# Altium project BEE-1012 PAY-EXP_V110.PrjPcb (part 5 of 7)

## Sheet 12_CONSOLE.SchDoc
size 420 x 297 mm; SheetNumber: 21; SheetTotal: 36
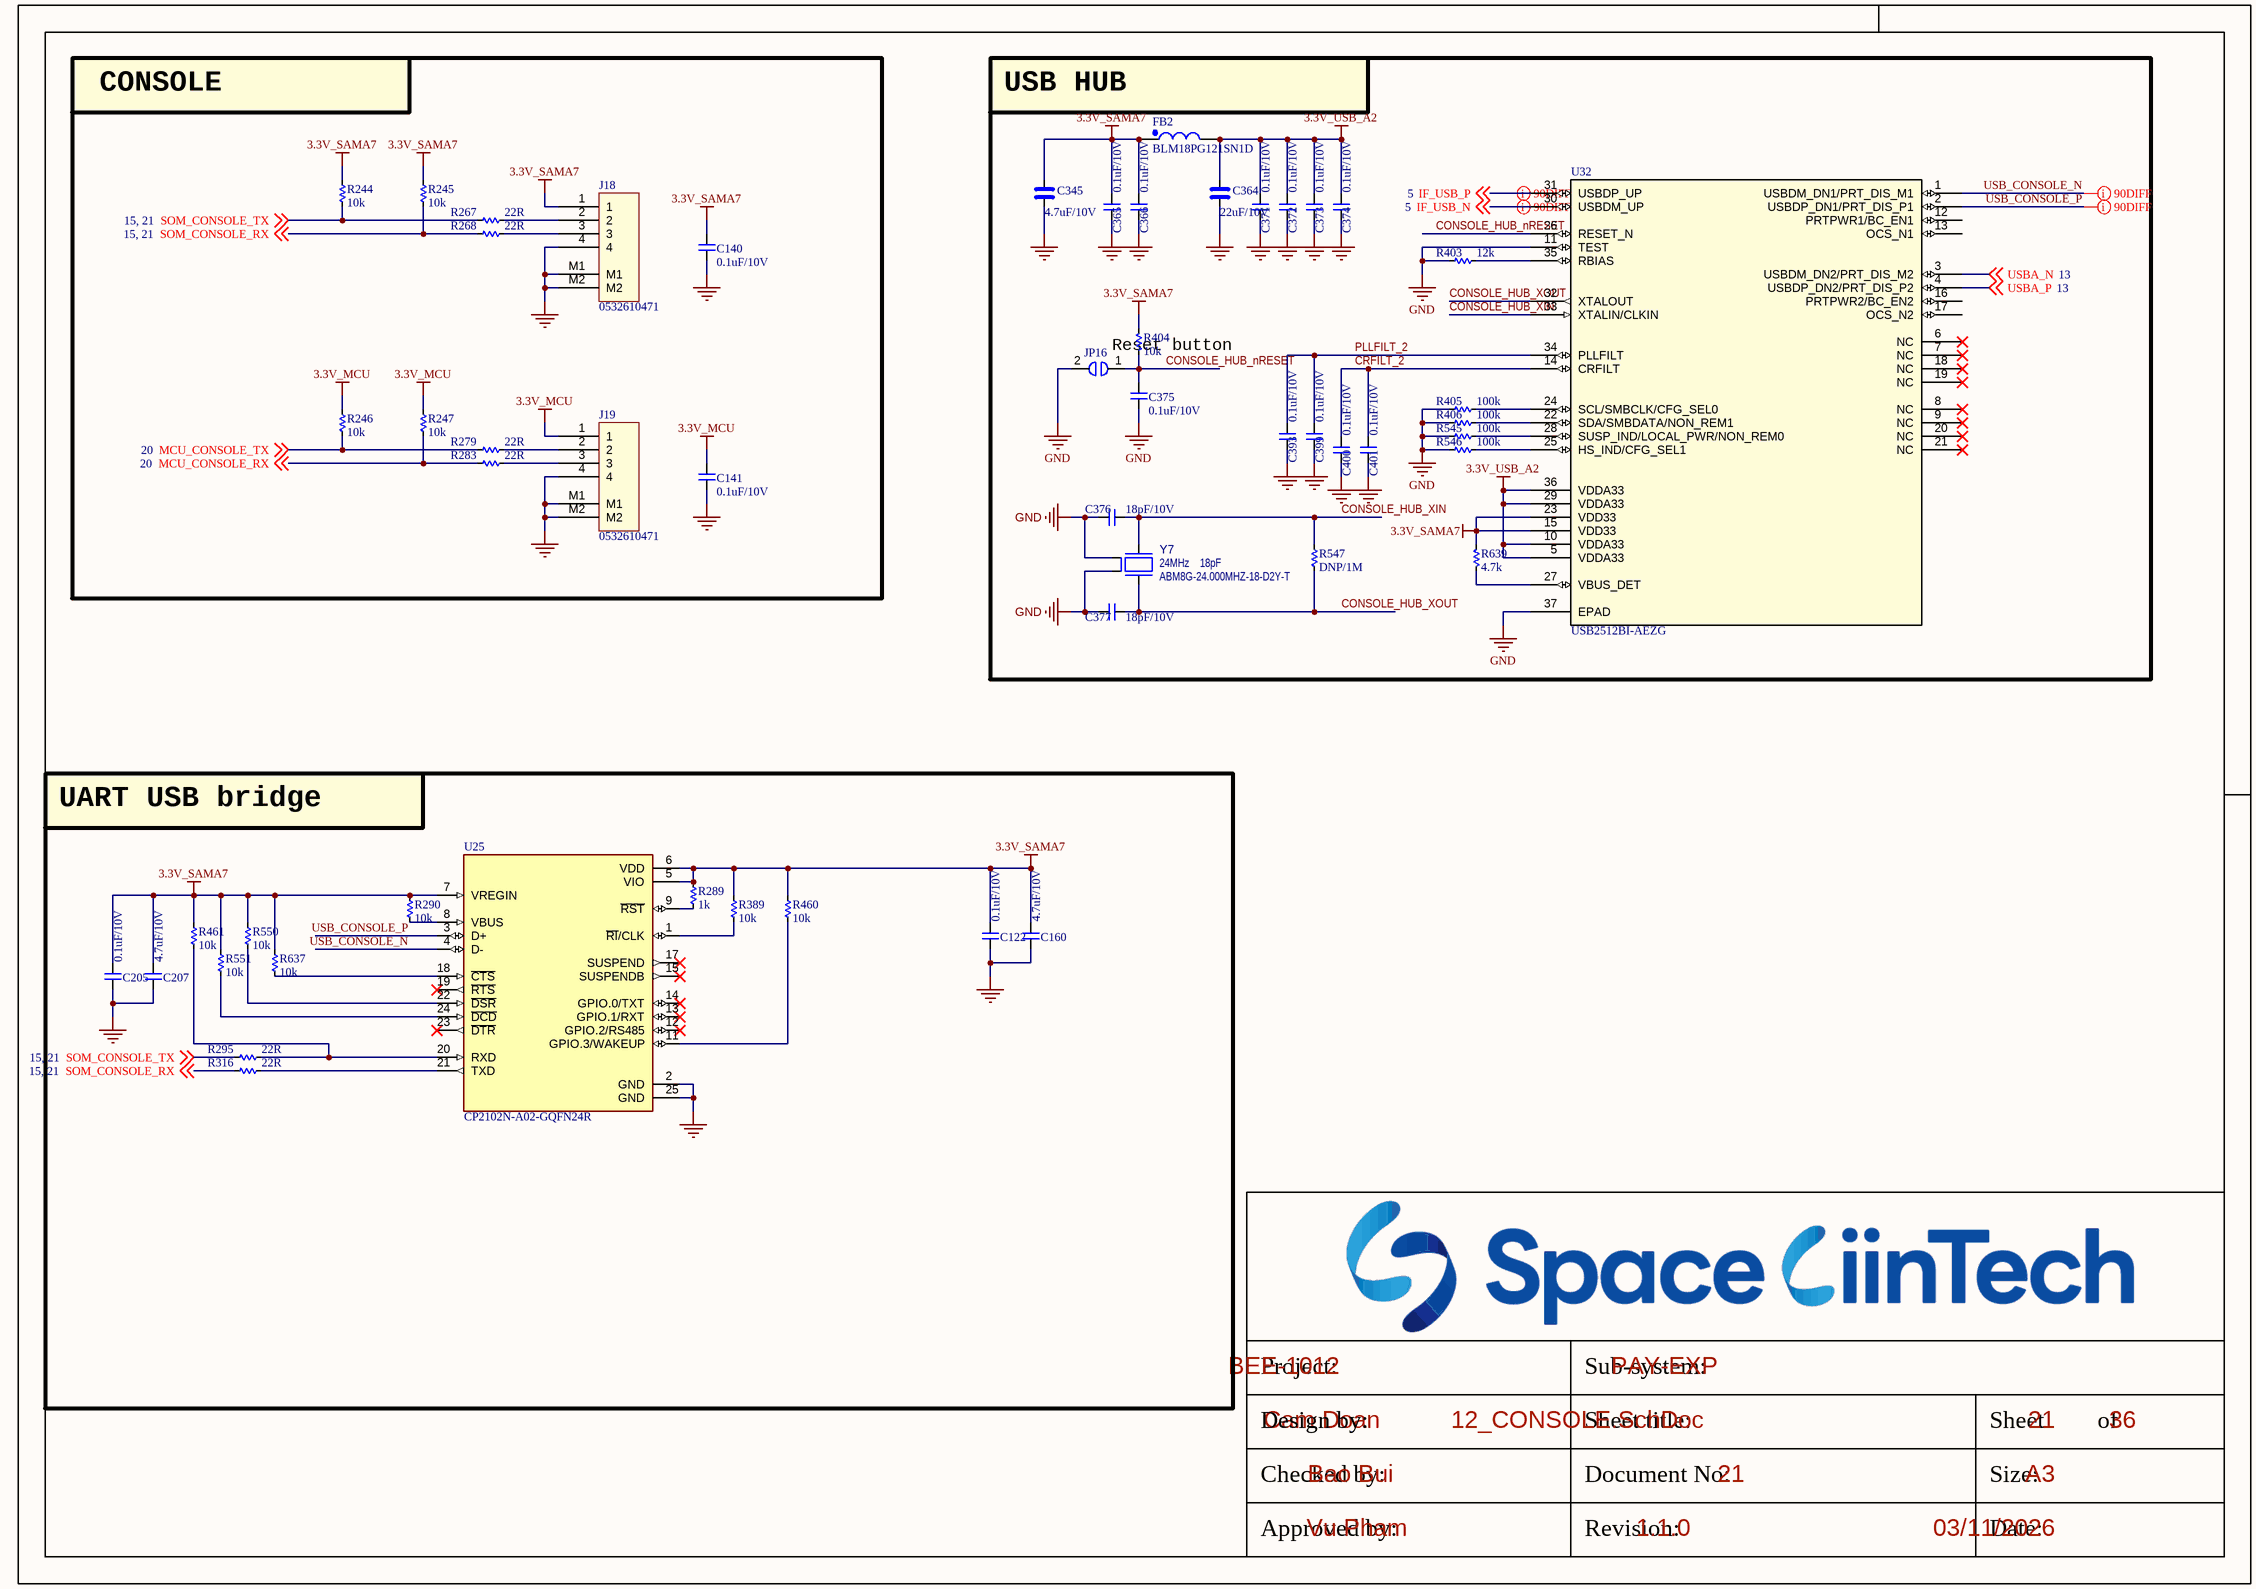
[diagram p22: 12_CONSOLE.SchDoc]

### Parts
C122  0.1uF/10V  [CAP_C_1005X60]
C140  0.1uF/10V  [CAP_C_1005X60]
C141  0.1uF/10V  [CAP_C_1005X60]
C160  4.7uF/10V  [CAP_C_1005X60]
C205  0.1uF/10V  [CAP_C_1005X60]
C207  4.7uF/10V  [CAP_C_1005X60]
C345  4.7uF/10V  [CAP_C_1608X80]
C364  22uF/10V  [CAP_C_1608X80]
C365  0.1uF/10V  [CAP_C_1005X60]
C366  0.1uF/10V  [CAP_C_1005X60]
C371  0.1uF/10V  [CAP_C_1005X60]
C372  0.1uF/10V  [CAP_C_1005X60]
C373  0.1uF/10V  [CAP_C_1005X60]
C374  0.1uF/10V  [CAP_C_1005X60]
C375  0.1uF/10V  [CAP_C_1005X60]
C376  18pF/10V  [CAP_C_1005X60]
C377  18pF/10V  [CAP_C_1005X60]
C393  0.1uF/10V  [CAP_C_1005X60]
C399  0.1uF/10V  [CAP_C_1005X60]
C400  0.1uF/10V  [CAP_C_1005X60]
C401  0.1uF/10V  [CAP_C_1005X60]
FB2  BLM18PG121SN1D  [IND_C_1608X60]
J18  0532610471  [MOLEX_0532610471]
J19  0532610471  [MOLEX_0532610471]
JP16  (no value)  [TESTPOINT_SHORT_120X100_60]
R244  10k  [RES_C_1005X40]
R245  10k  [RES_C_1005X40]
R246  10k  [RES_C_1005X40]
R247  10k  [RES_C_1005X40]
R267  22R  [RES_C_1005X40]
R268  22R  [RES_C_1005X40]
R279  22R  [RES_C_1005X40]
R283  22R  [RES_C_1005X40]
R289  1k  [RES_C_1005X40]
R290  10k  [RES_C_1005X40]
R295  22R  [RES_C_1005X40]
R316  22R  [RES_C_1005X40]
R389  10k  [RES_C_1005X40]
R403  12k  [RES_C_1005X40]
R404  10k  [RES_C_1005X40]
R405  100k  [RES_C_1005X40]
R406  100k  [RES_C_1005X40]
R460  10k  [RES_C_1005X40]
R461  10k  [RES_C_1005X40]
R545  100k  [RES_C_1005X40]
R546  100k  [RES_C_1005X40]
R547  DNP/1M  [RES_C_1005X40]
R550  10k  [RES_C_1005X40]
R551  10k  [RES_C_1005X40]
R637  10k  [RES_C_1005X40]
R639  4.7k  [RES_C_1005X40]
U25  CP2102N-A02-GQFN24R  [QFN50P400X400X80-25N]
U32  USB2512BI-AEZG  [QFN36_6X6MC_MCH]
Y7  value 24MHz  Load Capacitance: 18pF  Manufacturer Part Number 1: ABM8G-24.000MHZ-18-D2Y-T  [CRYSTAL_ABM8G]  (hidden comment: Crystal 4 Pins)

### Blocks framed on the sheet
CONSOLE: C140 C141 J18 J19 R244-R247 R267 R268 R279 R283
USB HUB: C345 C364-C366 C371-C377 C393 C399-C401 FB2 JP16 R403-R406 R545-R547 R639 U32 Y7
UART USB bridge: C122 C160 C205 C207 R289 R290 R295 R316 R389 R460 R461 R550 R551 R637 U25

### Nets
3.3V_MCU: C141.2 J19.1 R246.2 R247.2
3.3V_SAMA7: C122.1 C140.2 C160.1 C205.1 C207.1 C345.1 C365.2 C366.2 FB2.1 J18.1 R244.2 R245.2 R289.2 R290.2 R389.2 R404.1 R460.2 R461.2 R550.2 R551.2 R637.2 R639.1 U25.5(VIO) U25.6(VDD) U25.7(VREGIN) U32.15(VDD33) U32.23(VDD33)
3.3V_USB_A2: C364.1 C371.2 C372.2 C373.2 C374.2 FB2.2 U32.5(VDDA33) U32.10(VDDA33) U32.29(VDDA33) U32.36(VDDA33)
GND: C122.2 C140.1 C141.1 C160.2 C205.2 C207.2 C345.2 C364.2 C365.1 C366.1 C371.1 C372.1 C373.1 C374.1 C375.1 C376.2 C377.2 C393.1 C399.1 C400.1 C401.1 J18.4 J18.M1 J18.M2 J19.4 J19.M1 J19.M2 JP16.2 R403.1 R405.1 R406.1 R545.1 R546.1 U25.2(GND) U25.25(GND) U32.11(TEST) U32.37(EPAD) Y7.2(GND) Y7.4(GND)
CONSOLE_HUB_nRESET: C375.2 JP16.1 R404.2 U32.26(RESET_N)
CONSOLE_HUB_XIN: C376.1 R547.1 U32.33(XTALIN/CLKIN) Y7.3(Osc2)
CONSOLE_HUB_XOUT: C377.1 R547.2 U32.32(XTALOUT) Y7.1(Osc1)
CRFILT_2: C400.2 C401.2 U32.14(CRFILT)
IF_USB_N: U32.30(USBDM_UP) ; off-sheet IF_USB_N
IF_USB_P: U32.31(USBDP_UP) ; off-sheet IF_USB_P
MCU_CONSOLE_RX: R247.1 R283.2 ; off-sheet MCU_CONSOLE_RX
MCU_CONSOLE_TX: R246.1 R279.2 ; off-sheet MCU_CONSOLE_TX
PLLFILT_2: C393.2 C399.2 U32.34(PLLFILT)
SOM_CONSOLE_RX: R245.1 R268.2 R316.2 ; off-sheet SOM_CONSOLE_RX
SOM_CONSOLE_TX: R244.1 R267.2 R295.2 ; off-sheet SOM_CONSOLE_TX
USB_CONSOLE_N: U25.4(D-) U32.1(USBDM_DN1/PRT_DIS_M1)
USB_CONSOLE_P: U25.3(D+) U32.2(USBDP_DN1/PRT_DIS_P1)
USBA_N: U32.3(USBDM_DN2/PRT_DIS_M2) ; off-sheet USBA_N
USBA_P: U32.4(USBDP_DN2/PRT_DIS_P2) ; off-sheet USBA_P
NetJ18_2: J18.2 R267.1
NetJ18_3: J18.3 R268.1
NetJ19_2: J19.2 R279.1
NetJ19_3: J19.3 R283.1
NetR289_1: R289.1 U25.9(~{RST})
NetR290_1: R290.1 U25.8(VBUS)
NetR295_1: R295.1 R461.1 U25.20(RXD)
NetR316_1: R316.1 U25.21(TXD)
NetR389_1: R389.1 U25.1(~{RI}/CLK)
NetR403_2: R403.2 U32.35(RBIAS)
NetR405_2: R405.2 U32.24(SCL/SMBCLK/CFG_SEL0)
NetR406_2: R406.2 U32.22(SDA/SMBDATA/NON_REM1)
NetR460_1: R460.1 U25.11(GPIO.3/WAKEUP)
NetR545_2: R545.2 U32.28(SUSP_IND/LOCAL_PWR/NON_REM0)
NetR546_2: R546.2 U32.25(HS_IND/CFG_SEL1)
NetR550_1: R550.1 U25.22(~{DSR})
NetR551_1: R551.1 U25.24(~{DCD})
NetR637_1: R637.1 U25.18(~{CTS})
NetR639_2: R639.2 U32.27(VBUS_DET)

Not connected (* = marked no-connect by the designer): U25 12(GPIO.2/RS485)* 13(GPIO.1/RXT)* 14(GPIO.0/TXT)* 15(SUSPENDB)* 17(SUSPEND)* 19(~{RTS})* 23(~{DTR})*; U32 6(NC)* 7(NC)* 8(NC)* 9(NC)* 12(PRTPWR1/BC_EN1) 13(OCS_N1) 16(PRTPWR2/BC_EN2) 17(OCS_N2) 18(NC)* 19(NC)* 20(NC)* 21(NC)*

### Layout directives
differential pair; differential pair class DIFF90: IF_USB_N, IF_USB_P, USB_CONSOLE_N, USB_CONSOLE_P

### Notes on the sheet
- (near JP16) Reset button
- Project:
- Sub-system:
- Design by:
- Sheet title:
- Sheet
- of
- Checked by:
- Approved by:
- Revision:
- Document No:
- Size:
- Date:
- A3

### Library data of the parts
C122 C140 C141 C160 C205 C207 = _CAP_C_2: CAP
C345 C364 = _CAP_C_High_2: CAP CHIP High Value
C365 C366 C371-C377 C393 C399-C401 = _CAP_C_2: CAP CHIP
FB2 = _IND
J18 J19 = Header 4x1_2M
JP16 = JUMPER_1_1
R244-R247 R267 R268 R279 R283 R289 R290 R295 R316 R389 R403-R406 R460 R461 R545-R547 R550 R551 R637 R639 = _RES_B_2: RES
U25 = IC_USB_toUART_CP2102N-A02-GQFN24R: Value: *; MP: CP2102N-A02-GQFN24R; Package: None; Availability: Unavailable; Price: None
U32 = IC_USB_HUB_USB2512BI-AEZG: Description; Manufacturer_Name: Microchip; Copyright: Copyright (C) 2026 Ultra Librarian. All rights reserved.; Manufacturer_Part_Number: USB2512BI-AEZG; RefDes: RefDes; Type: Type
Y7 = OSC1047: Crystal; Manufacturer 1: Abracon Corporation; Description_: CRYSTAL 24MHz 18pF SMD ABM8G; Dev Tools Status: Production; Owner: Mark Loper; Populated: DNP; MCHP-ID: OSC1047; Revision: 1; Symbol: Crystal 4 Pins; Status: MCL Design; ComponentLink1URL: https://chn-vm-apps.microchip.com/mchprepo/parts/Datasheets/ABM8G.pdf; ComponentLink1Description: SVN Datasheet; ComponentLink2URL: C:\ALTIUM_WORK\00001_MCHP-CDB\Datasheets\ABM8G.pdf; ComponentLink2Description: Local Datasheet; ComponentLink3URL: C:\ALTIUM_WORK\00001_MCHP-CDB\Library\LibraryRefs\Crystal 4 Pins.SchLib; ComponentLink3Description: Open Symbol; ComponentLink4URL: C:\ALTIUM_WORK\00001_MCHP-CDB\Library\Footprints\CRYSTAL_ABM8G.PcbLib; ComponentLink4Description: Open Footprint; ComponentLink5Description: Open Footprint 2; ComponentLink6Description: Open Footprint 3; ComponentLink7Description: Open Footprint 4; Package: ABM8G; Type: Crystal; Category: Crystal/Oscillator; Supplier 1: Digi-Key; Supplier Part Number 1: 535-10273-1-ND; Quantity Override: 1

## Sheet 13_MRAM_RTC_WDT.SchDoc
size 420 x 297 mm; SheetNumber: 22; SheetTotal: 36
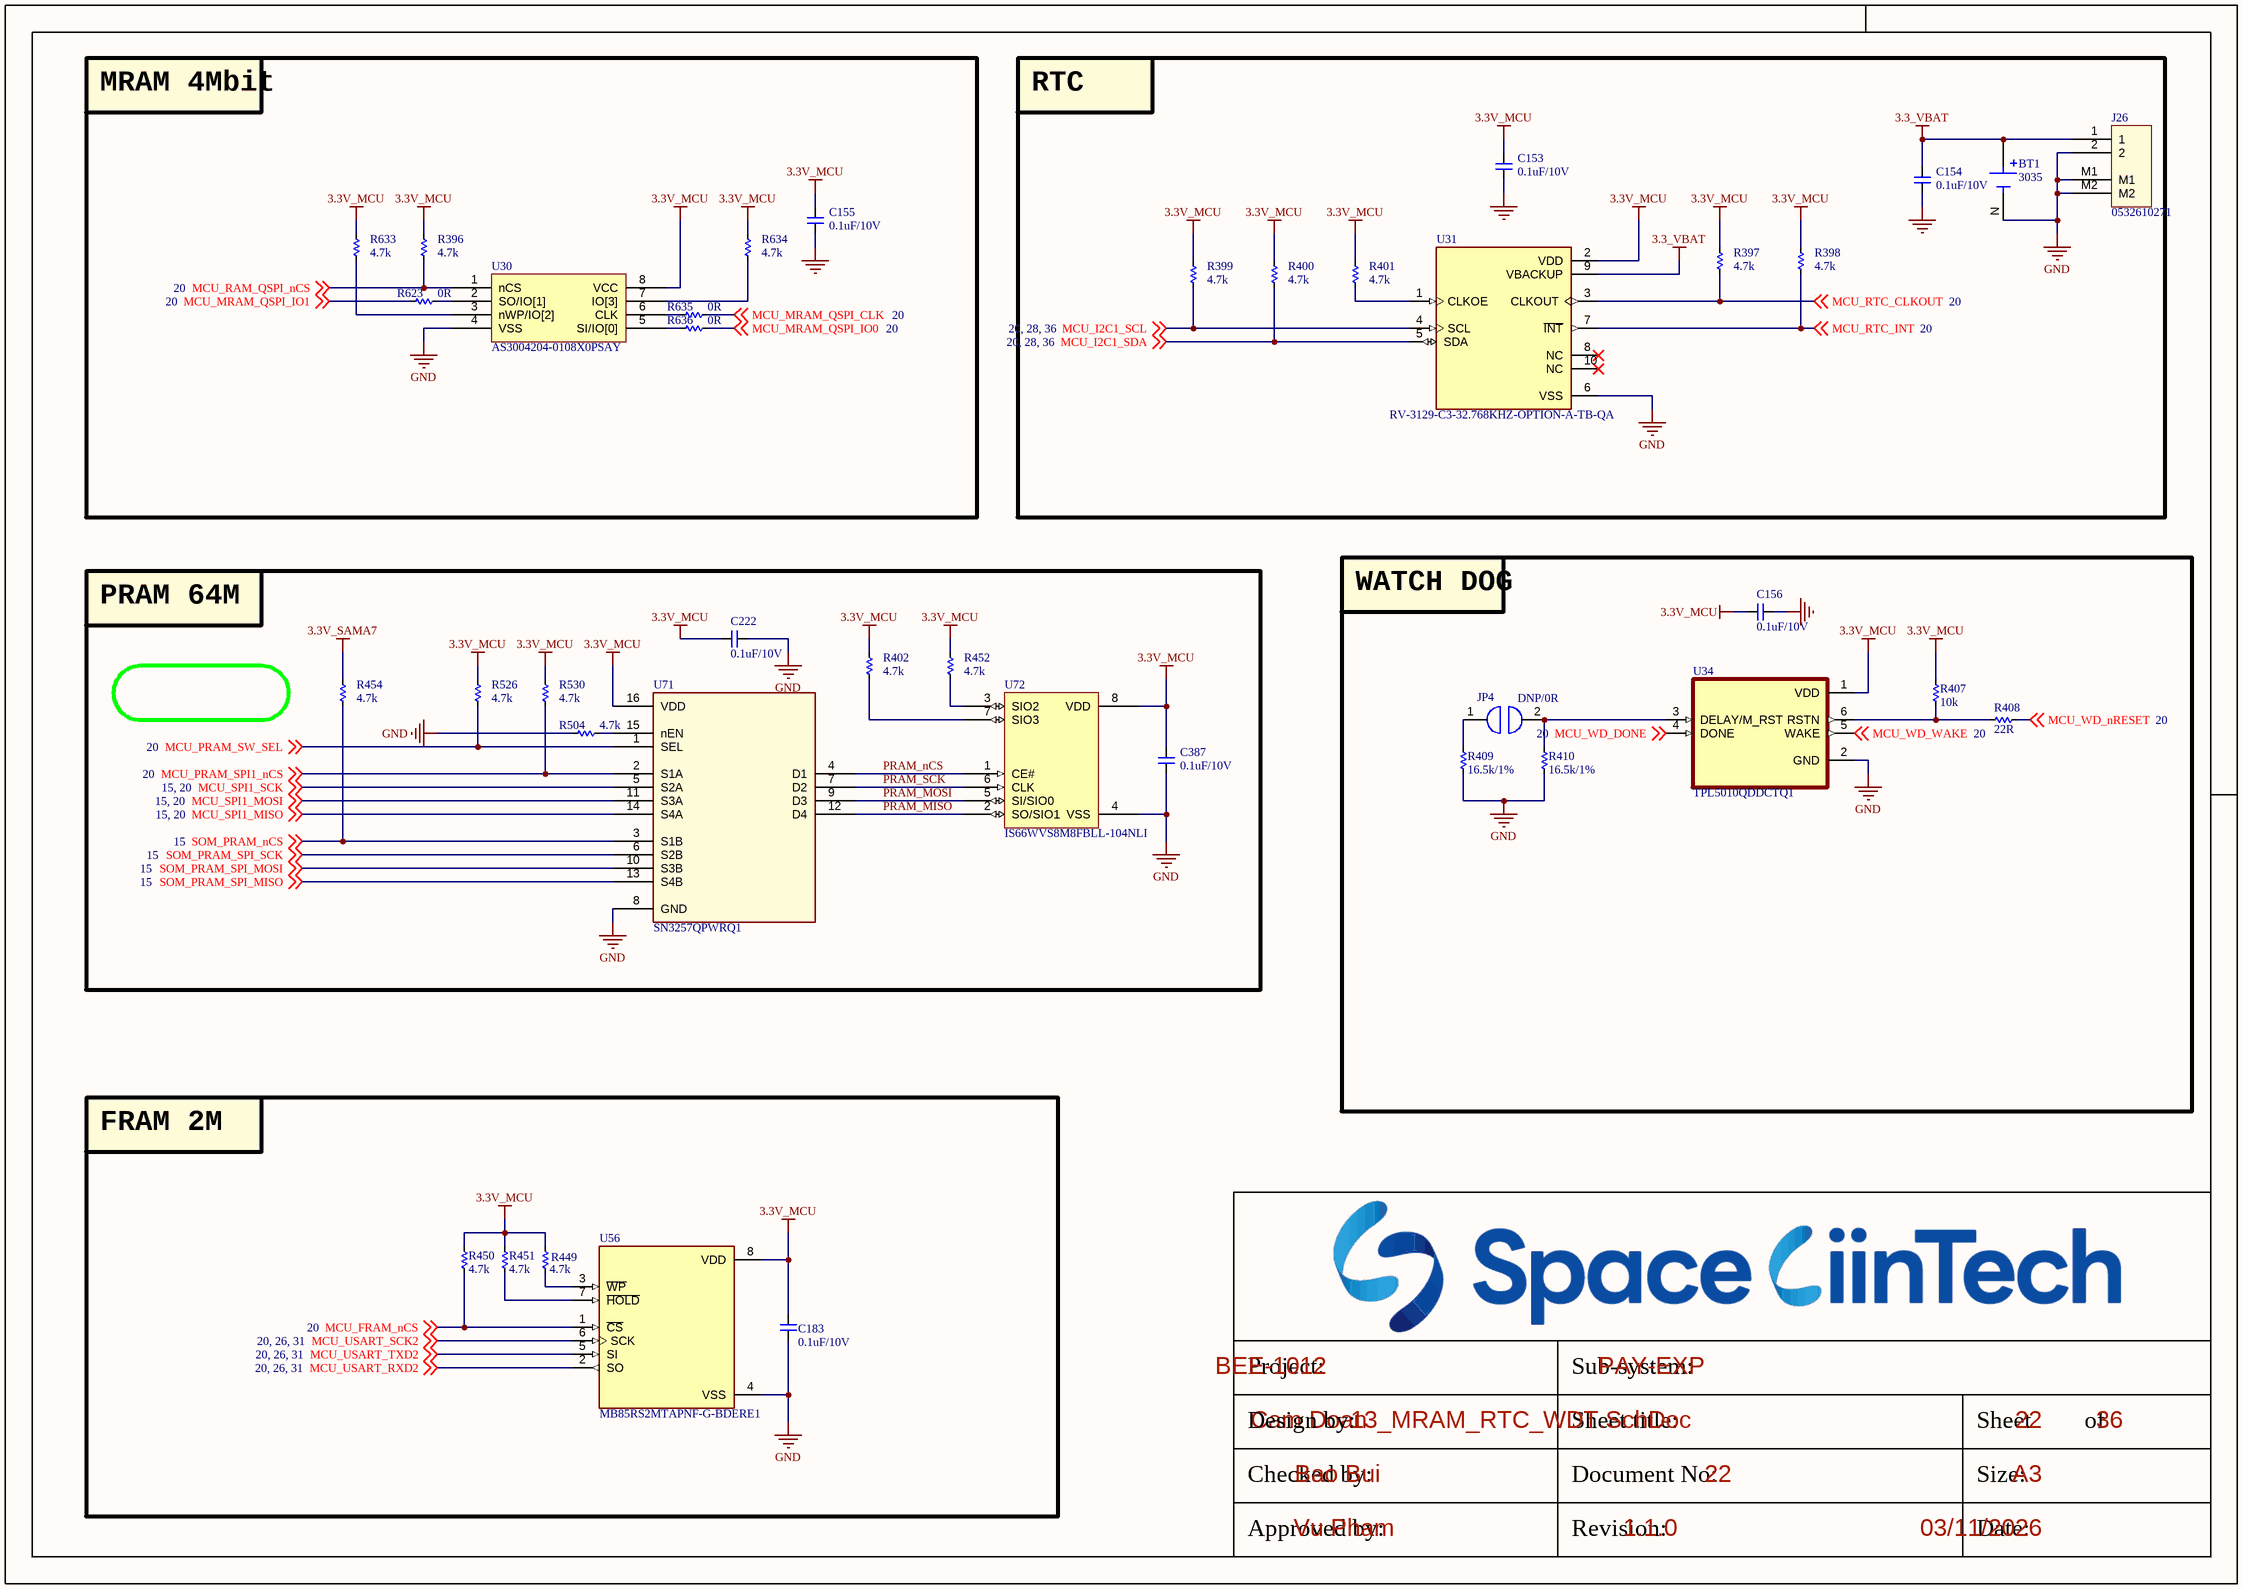
[diagram p23: 13_MRAM_RTC_WDT.SchDoc]

### Parts
(Parts that share a designator on the sheet are numbered #1, #2 ... from top to bottom, then left to right.)
BT1  3035  [BAT_3035]
C153  0.1uF/10V  [CAP_C_1005X60]
C154  0.1uF/10V  [CAP_C_1005X60]
C155  0.1uF/10V  [CAP_C_1005X60]
C156  0.1uF/10V  [CAP_C_1005X60]
C183  0.1uF/10V  [CAP_C_1005X60]
C222  0.1uF/10V  [CAP_C_1005X60]
C387#1  0.1uF/10V  [CAP_C_1005X60]
J26  0532610271  [molex_0532610271]
JP4  DNP/0R  [JUMPER_1608]
R396  4.7k  [RES_C_1005X40]
R397  4.7k  [RES_C_1005X40]
R398  4.7k  [RES_C_1005X40]
R399  4.7k  [RES_C_1005X40]
R400  4.7k  [RES_C_1005X40]
R401  4.7k  [RES_C_1005X40]
R402  4.7k  [RES_C_1005X40]
R407  10k  [RES_C_1005X40]
R408  22R  [RES_C_1005X40]
R409  16.5k/1%  [RES_C_1005X40]
R410  16.5k/1%  [RES_C_1005X40]
R449  4.7k  [RES_C_1005X40]
R450  4.7k  [RES_C_1005X40]
R451  4.7k  [RES_C_1005X40]
R452  4.7k  [RES_C_1005X40]
R454  4.7k  [RES_C_1005X40]
R504  4.7k  [RES_C_1005X40]
R526  4.7k  [RES_C_1005X40]
R530  4.7k  [RES_C_1005X40]
R623  0R  [RES_C_1005X40]
R633  4.7k  [RES_C_1005X40]
R634  4.7k  [RES_C_1005X40]
R635  0R  [RES_C_1005X40]
R636  0R  [RES_C_1005X40]
U30  AS3004204-0108X0PSAY  [SOIC127P790X216-8]
U31  RV-3129-C3-32.768KHZ-OPTION-A-TB-QA  [IC_RV-3129-C3_32.768KHZ_OPTION_A_TB_QA]
U34  TPL5010QDDCTQ1  [SOT95P280X145-6N]
U56  MB85RS2MTAPNF-G-BDERE1  [SOIC127P602X173-8N]
U71#1  SN3257QPWRQ1  [SOIC_PRQ1_TEX]
U72#1  IS66WVS8M8FBLL-104NLI  [SOIC8_150MIL_N_ISI]

### Blocks framed on the sheet
MRAM 4Mbit: C155 R396 R623 R633-R636 U30
RTC: BT1 C153 C154 J26 R397-R401 U31
PRAM 64M: C222 C387#1 R402 R452 R454 R504 R526 R530 U71#1 U72#1
WATCH DOG: C156 JP4 R407-R410 U34
FRAM 2M: C183 R449-R451 U56

### Nets
3.3_VBAT: BT1.P1(POS) BT1.P2(POS) C154.2 J26.1 U31.9(VBACKUP)
3.3V_MCU: C153.2 C155.2 C156.2 C183.2 C222.1 C387#1.1 R396.2 R397.2 R398.2 R399.2 R400.2 R401.1 R402.2 R407.2 R449.2 R450.2 R451.2 R452.2 R526.2 R530.2 R633.2 R634.2 U30.8(VCC) U31.2(VDD) U34.1(VDD) U56.8(VDD) U71#1.16(VDD) U72#1.8(VDD)
3.3V_SAMA7: R454.2
GND: BT1.N(NEG) C153.1 C154.1 C155.1 C156.1 C183.1 C222.2 C387#1.2 J26.2 J26.M1 J26.M2 R409.1 R410.1 R504.2 U30.4(VSS) U31.6(VSS) U34.2(GND) U56.4(VSS) U71#1.8(GND) U72#1.4(VSS)
MCU_FRAM_nCS: R450.1 U56.1(~{CS}) ; off-sheet MCU_FRAM_nCS
MCU_I2C1_SCL: R399.1 U31.4(SCL) ; off-sheet MCU_I2C1_SCL
MCU_I2C1_SDA: R400.1 U31.5(SDA) ; off-sheet MCU_I2C1_SDA
MCU_MRAM_QSPI_CLK: R635.1 ; off-sheet MCU_MRAM_QSPI_CLK
MCU_MRAM_QSPI_IO0: R636.1 ; off-sheet MCU_MRAM_QSPI_IO0
MCU_MRAM_QSPI_IO1: R623.2 ; off-sheet MCU_MRAM_QSPI_IO1
MCU_PRAM_SPI1_nCS: R530.1 U71#1.2(S1A) ; off-sheet MCU_PRAM_SPI1_nCS
MCU_PRAM_SW_SEL: R526.1 U71#1.1(SEL) ; off-sheet MCU_PRAM_SW_SEL
MCU_RAM_QSPI_nCS: R396.1 U30.1(nCS) ; off-sheet MCU_RAM_QSPI_nCS
MCU_RTC_CLKOUT: R397.1 U31.3(CLKOUT) ; off-sheet MCU_RTC_CLKOUT
MCU_RTC_INT: R398.1 U31.7(~{INT}) ; off-sheet MCU_RTC_INT
MCU_SPI1_MISO: U71#1.14(S4A) ; off-sheet MCU_SPI1_MISO
MCU_SPI1_MOSI: U71#1.11(S3A) ; off-sheet MCU_SPI1_MOSI
MCU_SPI1_SCK: U71#1.5(S2A) ; off-sheet MCU_SPI1_SCK
MCU_USART_RXD2: U56.2(SO) ; off-sheet MCU_USART_RXD2
MCU_USART_SCK2: U56.6(SCK) ; off-sheet MCU_USART_SCK2
MCU_USART_TXD2: U56.5(SI) ; off-sheet MCU_USART_TXD2
MCU_WD_DONE: U34.4(DONE) ; off-sheet MCU_WD_DONE
MCU_WD_nRESET: R408.1 ; off-sheet MCU_WD_nRESET
MCU_WD_WAKE: U34.5(WAKE) ; off-sheet MCU_WD_WAKE
PRAM_MISO: U71#1.12(D4) U72#1.2(SO/SIO1)
PRAM_MOSI: U71#1.9(D3) U72#1.5(SI/SIO0)
PRAM_nCS: U71#1.4(D1) U72#1.1(CE#)
PRAM_SCK: U71#1.7(D2) U72#1.6(CLK)
SOM_PRAM_nCS: R454.1 U71#1.3(S1B) ; off-sheet SOM_PRAM_nCS
SOM_PRAM_SPI_MISO: U71#1.13(S4B) ; off-sheet SOM_PRAM_SPI_MISO
SOM_PRAM_SPI_MOSI: U71#1.10(S3B) ; off-sheet SOM_PRAM_SPI_MOSI
SOM_PRAM_SPI_SCK: U71#1.6(S2B) ; off-sheet SOM_PRAM_SPI_SCK
NetJP4_1: JP4.1 R409.2
NetJP4_2: JP4.2 R410.2 U34.3(DELAY/M_RST)
NetR401_2: R401.2 U31.1(CLKOE)
NetR402_1: R402.1 U72#1.7(SIO3)
NetR407_1: R407.1 R408.2 U34.6(RSTN)
NetR449_1: R449.1 U56.3(~{WP})
NetR451_1: R451.1 U56.7(~{HOLD})
NetR452_1: R452.1 U72#1.3(SIO2)
NetR504_1: R504.1 U71#1.15(nEN)
NetR623_1: R623.1 U30.2(SO/IO[1])
NetR633_1: R633.1 U30.3(nWP/IO[2])
NetR634_1: R634.1 U30.7(IO[3])
NetR635_2: R635.2 U30.6(CLK)
NetR636_2: R636.2 U30.5(SI/IO[0])

Not connected (* = marked no-connect by the designer): U31 8(NC)* 10(NC)*

### Notes on the sheet
- Project:
- Sub-system:
- Design by:
- Sheet title:
- Sheet
- of
- Checked by:
- Approved by:
- Revision:
- Document No:
- Size:
- Date:
- A3

### Library data of the parts
BT1 = BT_HOLDER_3035: Battery Clip; THM; 20mm Cell; PhosBronze/Nickel | Keystone Electronics 3035; SnapEDA_Link: https://www.snapeda.com/parts/3035/Keystone/view-part/?ref=snap; Package: None; Value: *; MF: Keystone Electronics; MP: 3035; Check_prices: https://www.snapeda.com/parts/3035/Keystone/view-part/?ref=eda
C153-C156 C222 C387#1 = _CAP_C_2: CAP
C183 = _CAP_C_2: CAP CHIP
J26 = Header 2x1_2M
JP4 = JUMPER
R396-R402 R407-R410 R449-R452 R454 R504 R526 R530 R623 R633-R636 = _RES_B_2: RES
U30 = IC_RAM_AS3004204-0108X0PSAY
U31 = RV-3129-C3_32.768KHZ_OPTION_A_TB_QA: Real-Time Clock Module, Temperature compensated, in 2.5 x 3.7 mm package; MF: Micro Crystal; MP: RV-3129-C3 32.768KHZ OPTION A TB QA; SnapEDA_Link: https://www.snapeda.com/parts/RV-3129-C3%2032.768KHZ%20OPTION%20A%20TB%20QA/Micro+Crystal/view-part/?ref=snap; Package: QFN-10 Micro Crystal; Value: *; Check_prices: https://www.snapeda.com/parts/RV-3129-C3%2032.768KHZ%20OPTION%20A%20TB%20QA/Micro+Crystal/view-part/?ref=eda
U56 = MB85RS2MTAPNF-G-BDERE1: FRAM _Ferroelectric RAM_ Memory IC 2Mb _256K x 8_ SPI 40MHz 8-SOP; MF: Fujitsu Electronics; Package: SO-8 Fujitsu; Value: *; Digi-Key_Purchase_URL: https://www.digikey.com/product-detail/en/fujitsu-electronics-america-inc/MB85RS2MTAPNF-G-BDERE1/865-1286-1-ND/7916252?utm_source=snapeda&utm_medium=aggregator&utm_campaign=symbol; Digi-Key_Part_Number: 865-1286-1-ND; SnapEDA_Link: https://www.snapeda.com/parts/MB85RS2MTAPNF-G-BDERE1/Fujitsu%20Electronics%20America%2C%20Inc./view-part/2344795/?ref=snap; MP: MB85RS2MTAPNF-G-BDERE1
U71#1 = IC_SW_SPI_SN3257QPWRQ1: Automotive 5-V, 2:1 (SPDT), 4-channel switch with 1.8-V logic and powered-off protection 16-TSSOP -40 to 125; Manufacturer_Name: Texas Instruments; Copyright: Copyright (C) 2025 Ultra Librarian. All rights reserved.; Manufacturer_Part_Number: SN3257QPWRQ1; Datasheet: https://www.ti.com/lit/gpn/sn3257-q1; RefDes: RefDes; Type: Type
U72#1 = IS66WVS4M8BLL-104NLI: No Description Available; Manufacturer_Name: ISSI; Type: Memory; Copyright: Copyright (C) 2025 Ultra Librarian. All rights reserved.; Manufacturer_Part_Number: IS66WVS4M8BLL-104NLI; RefDes: RefDes
U34 = TPL5010QDDCTQ1: Package: None; Price: None; Value: *; MP: TPL5010QDDCTQ1; Availability: Unavailable

## Sheet 13_PRAM.SchDoc
size 420 x 297 mm; SheetNumber: 23; SheetTotal: 36
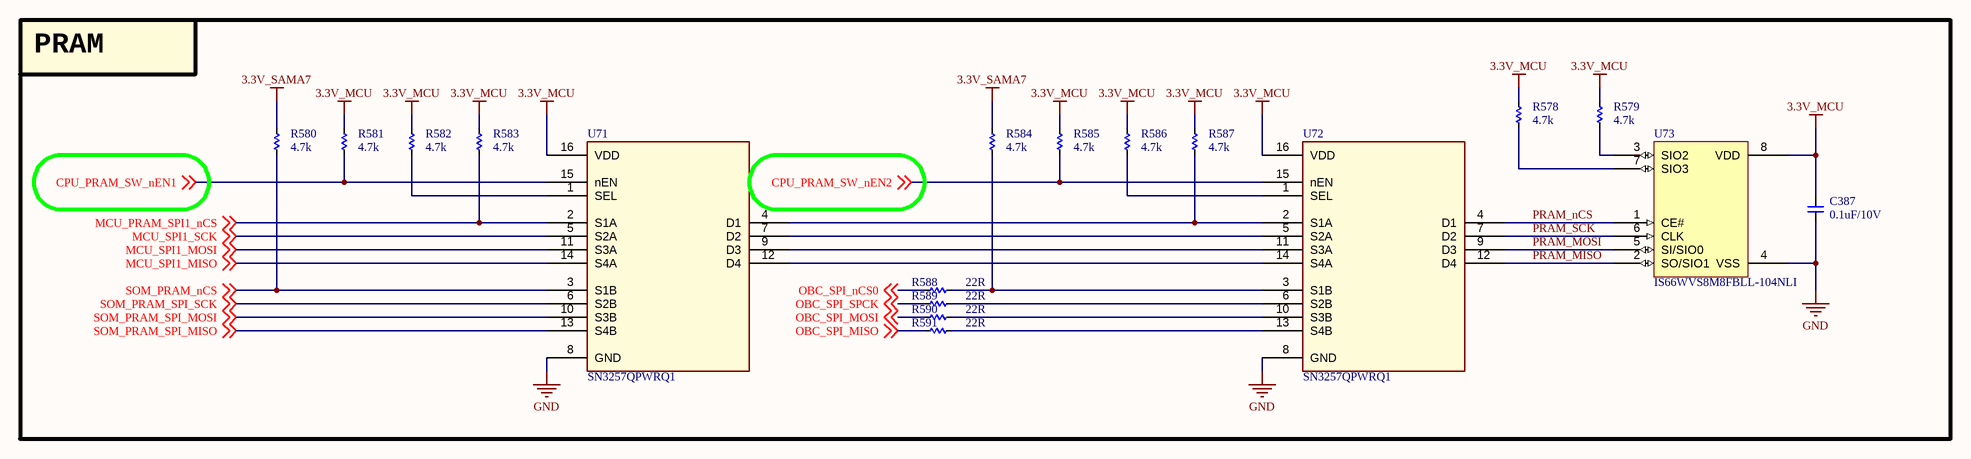
[diagram p24: 13_PRAM.SchDoc]

### Parts
(Parts that share a designator on the sheet are numbered #1, #2 ... from top to bottom, then left to right.)
C387#2  0.1uF/10V  [CAP_C_1005X50_L]
R578#2  4.7k  [RES_C_1005x30_L]
R579#2  4.7k  [RES_C_1005x30_L]
R580#2  4.7k  [RES_C_1005x30_L]
R581#2  4.7k  [RES_C_1005x30_L]
R582#2  4.7k  [RES_C_1005x30_L]
R583#2  4.7k  [RES_C_1005x30_L]
R584#2  4.7k  [RES_C_1005x30_L]
R585#2  4.7k  [RES_C_1005x30_L]
R586#2  4.7k  [RES_C_1005x30_L]
R587#2  4.7k  [RES_C_1005x30_L]
R588#2  22R  [RES_C_1005x30_L]
R589#2  22R  [RES_C_1005x30_L]
R590#2  22R  [RES_C_1005x30_L]
R591#2  22R  [RES_C_1005x30_L]
U71#2  SN3257QPWRQ1  [SOIC_PRQ1_TEX]
U72#2  SN3257QPWRQ1  [SOIC_PRQ1_TEX]
U73#1  IS66WVS8M8FBLL-104NLI  [SOIC8_150MIL_N_ISI]

### Blocks framed on the sheet
PRAM: C387#2 R578#2 R579#2 R580#2 R581#2 R582#2 R583#2 R584#2 R585#2 R586#2 R587#2 R588#2 R589#2 R590#2 R591#2 U71#2 U72#2 U73#1

### Nets
3.3V_MCU: C387#2.1 R578#2.2 R579#2.2 R581#2.2 R582#2.2 R583#2.2 R585#2.2 R586#2.2 R587#2.2 U71#2.16(VDD) U72#2.16(VDD) U73#1.8(VDD)
3.3V_SAMA7: R580#2.2 R584#2.2
GND: C387#2.2 U71#2.8(GND) U72#2.8(GND) U73#1.4(VSS)
CPU_PRAM_SW_nEN1: R581#2.1 U71#2.15(nEN) ; off-sheet CPU_PRAM_SW_nEN1
CPU_PRAM_SW_nEN2: R585#2.1 U72#2.15(nEN) ; off-sheet CPU_PRAM_SW_nEN2
MCU_PRAM_SPI1_nCS: R583#2.1 U71#2.2(S1A) ; off-sheet MCU_PRAM_SPI1_nCS
MCU_SPI1_MISO: U71#2.14(S4A) ; off-sheet MCU_SPI1_MISO
MCU_SPI1_MOSI: U71#2.11(S3A) ; off-sheet MCU_SPI1_MOSI
MCU_SPI1_SCK: U71#2.5(S2A) ; off-sheet MCU_SPI1_SCK
OBC_SPI_MISO: R591#2.2 ; off-sheet OBC_SPI_MISO
OBC_SPI_MOSI: R590#2.2 ; off-sheet OBC_SPI_MOSI
OBC_SPI_nCS0: R588#2.2 ; off-sheet OBC_SPI_nCS0
OBC_SPI_SPCK: R589#2.2 ; off-sheet OBC_SPI_SPCK
PRAM_MISO: U72#2.12(D4) U73#1.2(SO/SIO1)
PRAM_MOSI: U72#2.9(D3) U73#1.5(SI/SIO0)
PRAM_nCS: U72#2.4(D1) U73#1.1(CE#)
PRAM_SCK: U72#2.7(D2) U73#1.6(CLK)
SOM_PRAM_nCS: R580#2.1 U71#2.3(S1B) ; off-sheet SOM_PRAM_nCS
SOM_PRAM_SPI_MISO: U71#2.13(S4B) ; off-sheet SOM_PRAM_SPI_MISO
SOM_PRAM_SPI_MOSI: U71#2.10(S3B) ; off-sheet SOM_PRAM_SPI_MOSI
SOM_PRAM_SPI_SCK: U71#2.6(S2B) ; off-sheet SOM_PRAM_SPI_SCK
NetR578#2_1: R578#2.1 U73#1.7(SIO3)
NetR579#2_1: R579#2.1 U73#1.3(SIO2)
NetR582#2_1: R582#2.1 U71#2.1(SEL)
NetR584#2_1: R584#2.1 R588#2.1 U72#2.3(S1B)
NetR586#2_1: R586#2.1 U72#2.1(SEL)
NetR587#2_1: R587#2.1 U71#2.4(D1) U72#2.2(S1A)
NetR589#2_1: R589#2.1 U72#2.6(S2B)
NetR590#2_1: R590#2.1 U72#2.10(S3B)
NetR591#2_1: R591#2.1 U72#2.13(S4B)
NetU71#2_7: U71#2.7(D2) U72#2.5(S2A)
NetU71#2_9: U71#2.9(D3) U72#2.11(S3A)
NetU71#2_12: U71#2.12(D4) U72#2.14(S4A)

### Notes on the sheet
- Project:
- Sub-system:
- Design by:
- Sheet title:
- Sheet
- of
- Checked by:
- Approved by:
- Revision:
- Document No:
- Size:
- Date:
- A3

### Library data of the parts
C387#2 = _CAP_C_2: CAP
R578#2 R579#2 R580#2 R581#2 R582#2 R583#2 R584#2 R585#2 R586#2 R587#2 R588#2 R589#2 R590#2 R591#2 = _RES_B_2: RES
U71#2 U72#2 = IC_SW_SPI_SN3257QPWRQ1: as U71#1 on sheet 13_MRAM_RTC_WDT; Copyright: Copyright (C) 2025 Ultra Librarian. All rights reserved.; Manufacturer_Part_Number: SN3257QPWRQ1; Datasheet: https://www.ti.com/lit/gpn/sn3257-q1; RefDes: RefDes; Type: Type
U73#1 = IS66WVS4M8BLL-104NLI: as U72#1 on sheet 13_MRAM_RTC_WDT; Type: Memory; Copyright: Copyright (C) 2025 Ultra Librarian. All rights reserved.; Manufacturer_Part_Number: IS66WVS4M8BLL-104NLI; RefDes: RefDes

## Sheet 14_NTC_TEMPSENSOR.SchDoc
size 420 x 297 mm; SheetNumber: 24; SheetTotal: 36
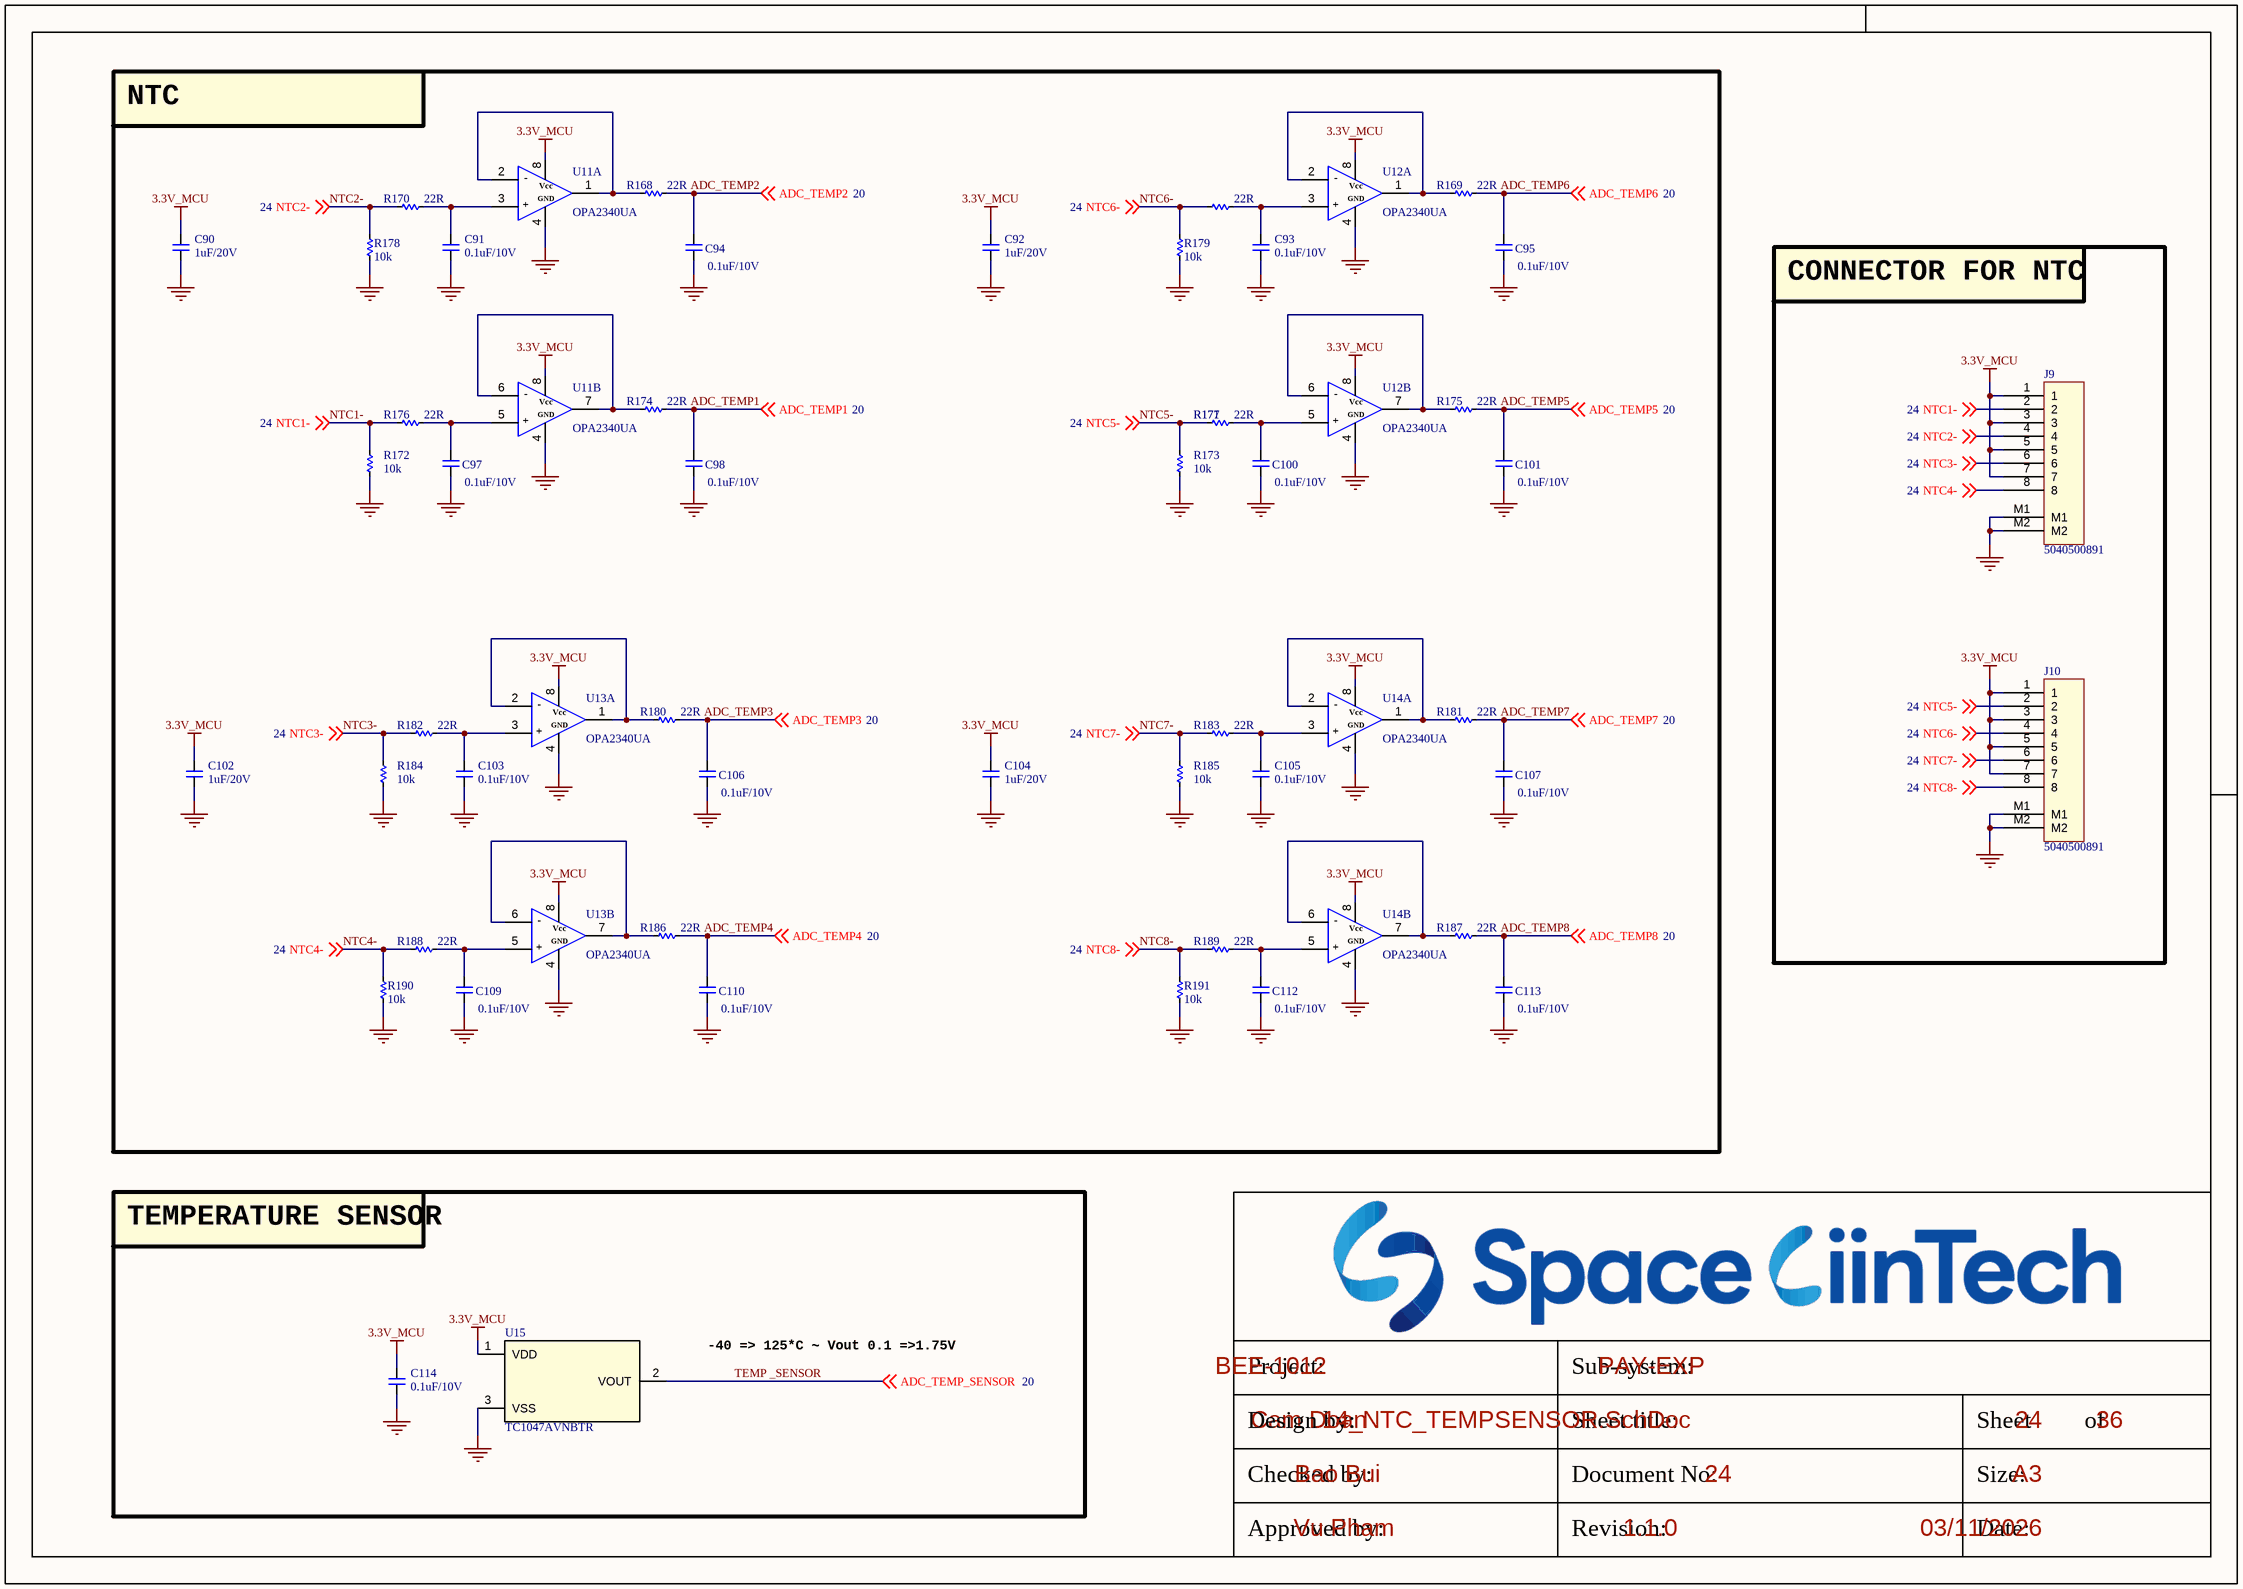
[diagram p25: 14_NTC_TEMPSENSOR.SchDoc]

### Parts
C90  1uF/20V  [CAP_C_1005X50_L]
C91  0.1uF/10V  [CAP_C_1005X50_L]
C92  1uF/20V  [CAP_C_1005X50_L]
C93  0.1uF/10V  [CAP_C_1005X50_L]
C94  0.1uF/10V  [CAP_C_1005X50_L]
C95  0.1uF/10V  [CAP_C_1005X50_L]
C97  0.1uF/10V  [CAP_C_1005X50_L]
C98  0.1uF/10V  [CAP_C_1005X50_L]
C100  0.1uF/10V  [CAP_C_1005X50_L]
C101  0.1uF/10V  [CAP_C_1005X50_L]
C102  1uF/20V  [CAP_C_1005X50_L]
C103  0.1uF/10V  [CAP_C_1005X50_L]
C104  1uF/20V  [CAP_C_1005X50_L]
C105  0.1uF/10V  [CAP_C_1005X50_L]
C106  0.1uF/10V  [CAP_C_1005X50_L]
C107  0.1uF/10V  [CAP_C_1005X50_L]
C109  0.1uF/10V  [CAP_C_1005X50_L]
C110  0.1uF/10V  [CAP_C_1005X50_L]
C112  0.1uF/10V  [CAP_C_1005X50_L]
C113  0.1uF/10V  [CAP_C_1005X50_L]
C114  0.1uF/10V  [CAP_C_1005X50_L]
J9  5040500891  [MOLEX_5040500891]
J10  5040500891  [MOLEX_5040500891]
R168  22R  [RES_C_1005x30_L]
R169  22R  [RES_C_1005x30_L]
R170  22R  [RES_C_1005x30_L]
R171  22R  [RES_C_1005x30_L]
R172  10k  [RES_C_1005x30_L]
R173  10k  [RES_C_1005x30_L]
R174  22R  [RES_C_1005x30_L]
R175  22R  [RES_C_1005x30_L]
R176  22R  [RES_C_1005x30_L]
R177  22R  [RES_C_1005x30_L]
R178  10k  [RES_C_1005x30_L]
R179  10k  [RES_C_1005x30_L]
R180  22R  [RES_C_1005x30_L]
R181  22R  [RES_C_1005x30_L]
R182  22R  [RES_C_1005x30_L]
R183  22R  [RES_C_1005x30_L]
R184  10k  [RES_C_1005x30_L]
R185  10k  [RES_C_1005x30_L]
R186  22R  [RES_C_1005x30_L]
R187  22R  [RES_C_1005x30_L]
R188  22R  [RES_C_1005x30_L]
R189  22R  [RES_C_1005x30_L]
R190  10k  [RES_C_1005x30_L]
R191  10k  [RES_C_1005x30_L]
U11  OPA2340UA  [SOIC127P602X173-8N]  (parts A,B of 2)
U12  OPA2340UA  [SOIC127P602X173-8N]  (parts A,B of 2)
U13  OPA2340UA  [SOIC127P602X173-8N]  (parts A,B of 2)
U14  OPA2340UA  [SOIC127P602X173-8N]  (parts A,B of 2)
U15  TC1047AVNBTR  [SOT95P240X120-3N]

### Blocks framed on the sheet
NTC: C90-C95 C97 C98 C100-C107 C109 C110 C112 C113 R168-R191 U11-U14
CONNECTOR FOR NTC: J9 J10
TEMPERATURE SENSOR: C114 U15

### Nets
3.3V_MCU: C90.2 C92.2 C102.2 C104.2 C114.2 J9.1 J9.3 J9.5 J9.7 J10.1 J10.3 J10.5 J10.7 U11.8 U12.8 U13.8 U14.8 U15.1(VDD)
GND: C90.1 C91.1 C92.1 C93.1 C94.1 C95.1 C97.1 C98.1 C100.1 C101.1 C102.1 C103.1 C104.1 C105.1 C106.1 C107.1 C109.1 C110.1 C112.1 C113.1 C114.1 J9.M1 J9.M2 J10.M1 J10.M2 R172.1 R173.1 R178.1 R179.1 R184.1 R185.1 R190.1 R191.1 U11.4 U12.4 U13.4 U14.4 U15.3(VSS)
ADC_TEMP1: C98.2 R174.2 ; off-sheet ADC_TEMP1
ADC_TEMP2: C94.2 R168.2 ; off-sheet ADC_TEMP2
ADC_TEMP3: C106.2 R180.2 ; off-sheet ADC_TEMP3
ADC_TEMP4: C110.2 R186.2 ; off-sheet ADC_TEMP4
ADC_TEMP5: C101.2 R175.2 ; off-sheet ADC_TEMP5
ADC_TEMP6: C95.2 R169.2 ; off-sheet ADC_TEMP6
ADC_TEMP7: C107.2 R181.2 ; off-sheet ADC_TEMP7
ADC_TEMP8: C113.2 R187.2 ; off-sheet ADC_TEMP8
NTC1-: J9.2 R172.2 R176.1 ; off-sheet NTC1-
NTC2-: J9.4 R170.1 R178.2 ; off-sheet NTC2-
NTC3-: J9.6 R182.1 R184.2 ; off-sheet NTC3-
NTC4-: J9.8 R188.1 R190.2 ; off-sheet NTC4-
NTC5-: J10.2 R173.2 R177.1 ; off-sheet NTC5-
NTC6-: J10.4 R171.1 R179.2 ; off-sheet NTC6-
NTC7-: J10.6 R183.1 R185.2 ; off-sheet NTC7-
NTC8-: J10.8 R189.1 R191.2 ; off-sheet NTC8-
TEMP _SENSOR: U15.2(VOUT) ; off-sheet ADC_TEMP_SENSOR  [also labelled ADC_TEMP_SENSOR]
NetC91_2: C91.2 R170.2 U11.3
NetC93_2: C93.2 R171.2 U12.3
NetC97_2: C97.2 R176.2 U11.5
NetC100_2: C100.2 R177.2 U12.5
NetC103_2: C103.2 R182.2 U13.3
NetC105_2: C105.2 R183.2 U14.3
NetC109_2: C109.2 R188.2 U13.5
NetC112_2: C112.2 R189.2 U14.5
NetR168_1: R168.1 U11.1 U11.2
NetR169_1: R169.1 U12.1 U12.2
NetR174_1: R174.1 U11.6 U11.7
NetR175_1: R175.1 U12.6 U12.7
NetR180_1: R180.1 U13.1 U13.2
NetR181_1: R181.1 U14.1 U14.2
NetR186_1: R186.1 U13.6 U13.7
NetR187_1: R187.1 U14.6 U14.7

### Notes on the sheet
- -40 => 125*C ~ Vout 0.1 =>1.75V
- Project:
- Sub-system:
- Design by:
- Sheet title:
- Sheet
- of
- Checked by:
- Approved by:
- Revision:
- Document No:
- Size:
- Date:
- A3
- (in symbol OPA2340UA, part A) -; Vcc; GND; +
- (in symbol OPA2340UA, part B) -; Vcc; GND; +

### Library data of the parts
C90-C95 C97 C98 C100-C107 C109 C110 C112-C114 = _CAP_C_2: CAP
J9 J10 = Header 8x1_2M
R168-R191 = _RES_B_2: RES
U15 = IC_SENSOR_TC1047AVNBTR: Temperature Sensor Analog, Local -40°C ~ 125°C 10mV/°C SOT-23-3

## Sheet 15_HEATER.SchDoc
size 420 x 297 mm; SheetNumber: 25; SheetTotal: 36
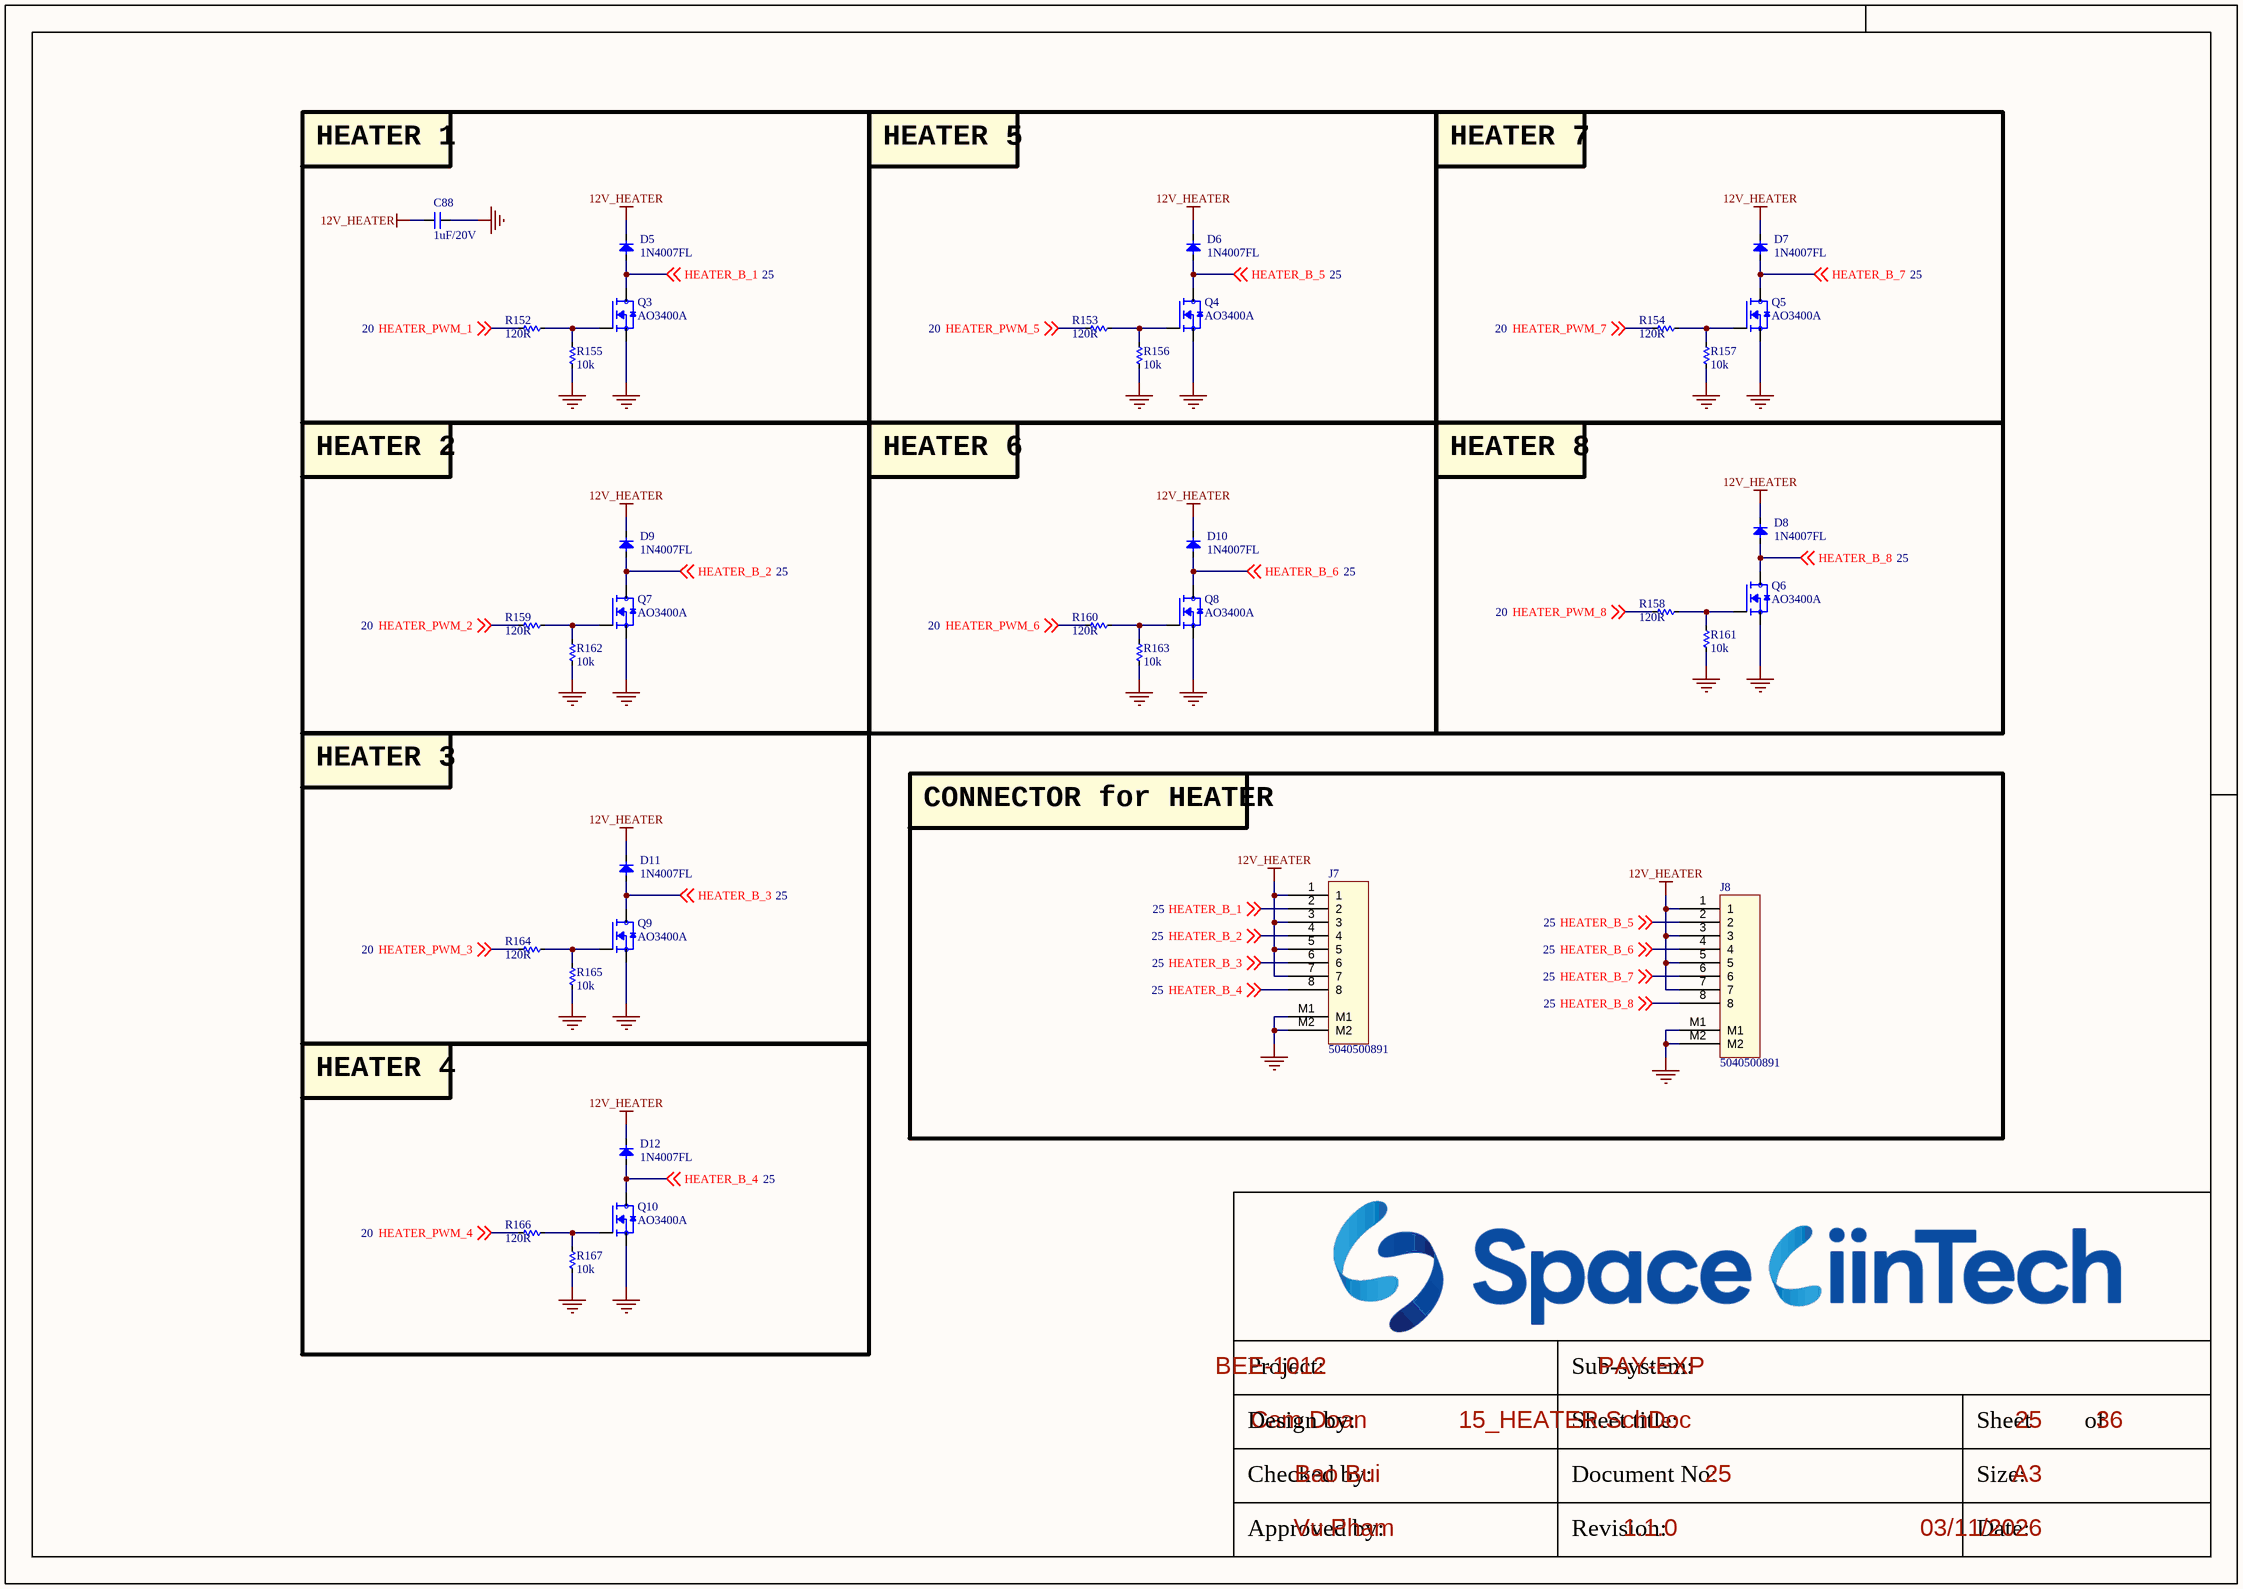
[diagram p26: 15_HEATER.SchDoc]

### Parts
C88  1uF/20V  [CAP_C_1005X50_L]
D5  1N4007FL  [SOD3717X145N]
D6  1N4007FL  [SOD3717X145N]
D7  1N4007FL  [SOD3717X145N]
D8  1N4007FL  [SOD3717X145N]
D9  1N4007FL  [SOD3717X145N]
D10  1N4007FL  [SOD3717X145N]
D11  1N4007FL  [SOD3717X145N]
D12  1N4007FL  [SOD3717X145N]
J7  5040500891  [MOLEX_5040500891]
J8  5040500891  [MOLEX_5040500891]
Q3  AO3400A  [SOT95P240X120-3N]
Q4  AO3400A  [SOT95P240X120-3N]
Q5  AO3400A  [SOT95P240X120-3N]
Q6  AO3400A  [SOT95P240X120-3N]
Q7  AO3400A  [SOT95P240X120-3N]
Q8  AO3400A  [SOT95P240X120-3N]
Q9  AO3400A  [SOT95P240X120-3N]
Q10  AO3400A  [SOT95P240X120-3N]
R152  120R  [RES_C_1005x30_L]
R153  120R  [RES_C_1005x30_L]
R154  120R  [RES_C_1005x30_L]
R155  10k  [RES_C_1005x30_L]
R156  10k  [RES_C_1005x30_L]
R157  10k  [RES_C_1005x30_L]
R158  120R  [RES_C_1005x30_L]
R159  120R  [RES_C_1005x30_L]
R160  120R  [RES_C_1005x30_L]
R161  10k  [RES_C_1005x30_L]
R162  10k  [RES_C_1005x30_L]
R163  10k  [RES_C_1005x30_L]
R164  120R  [RES_C_1005x30_L]
R165  10k  [RES_C_1005x30_L]
R166  120R  [RES_C_1005x30_L]
R167  10k  [RES_C_1005x30_L]

### Blocks framed on the sheet
HEATER 1: C88 D5 Q3 R152 R155
HEATER 5: D6 Q4 R153 R156
HEATER 7: D7 Q5 R154 R157
HEATER 2: D9 Q7 R159 R162
HEATER 6: D10 Q8 R160 R163
HEATER 8: D8 Q6 R158 R161
HEATER 3: D11 Q9 R164 R165
CONNECTOR for HEATER: J7 J8
HEATER 4: D12 Q10 R166 R167

### Nets
12V_HEATER: C88.2 D5.1(K) D6.1(K) D7.1(K) D8.1(K) D9.1(K) D10.1(K) D11.1(K) D12.1(K) J7.1 J7.3 J7.5 J7.7 J8.1 J8.3 J8.5 J8.7
GND: C88.1 J7.M1 J7.M2 J8.M1 J8.M2 Q3.2(S) Q4.2(S) Q5.2(S) Q6.2(S) Q7.2(S) Q8.2(S) Q9.2(S) Q10.2(S) R155.1 R156.1 R157.1 R161.1 R162.1 R163.1 R165.1 R167.1
HEATER_B_1: D5.2(A) J7.2 Q3.3(D) ; off-sheet HEATER_B_1
HEATER_B_2: D9.2(A) J7.4 Q7.3(D) ; off-sheet HEATER_B_2
HEATER_B_3: D11.2(A) J7.6 Q9.3(D) ; off-sheet HEATER_B_3
HEATER_B_4: D12.2(A) J7.8 Q10.3(D) ; off-sheet HEATER_B_4
HEATER_B_5: D6.2(A) J8.2 Q4.3(D) ; off-sheet HEATER_B_5
HEATER_B_6: D10.2(A) J8.4 Q8.3(D) ; off-sheet HEATER_B_6
HEATER_B_7: D7.2(A) J8.6 Q5.3(D) ; off-sheet HEATER_B_7
HEATER_B_8: D8.2(A) J8.8 Q6.3(D) ; off-sheet HEATER_B_8
HEATER_PWM_1: R152.1 ; off-sheet HEATER_PWM_1
HEATER_PWM_2: R159.1 ; off-sheet HEATER_PWM_2
HEATER_PWM_3: R164.1 ; off-sheet HEATER_PWM_3
HEATER_PWM_4: R166.1 ; off-sheet HEATER_PWM_4
HEATER_PWM_5: R153.1 ; off-sheet HEATER_PWM_5
HEATER_PWM_6: R160.1 ; off-sheet HEATER_PWM_6
HEATER_PWM_7: R154.1 ; off-sheet HEATER_PWM_7
HEATER_PWM_8: R158.1 ; off-sheet HEATER_PWM_8
NetQ3_1: Q3.1(G) R152.2 R155.2
NetQ4_1: Q4.1(G) R153.2 R156.2
NetQ5_1: Q5.1(G) R154.2 R157.2
NetQ6_1: Q6.1(G) R158.2 R161.2
NetQ7_1: Q7.1(G) R159.2 R162.2
NetQ8_1: Q8.1(G) R160.2 R163.2
NetQ9_1: Q9.1(G) R164.2 R165.2
NetQ10_1: Q10.1(G) R166.2 R167.2

### Notes on the sheet
- Project:
- Sub-system:
- Design by:
- Sheet title:
- Sheet
- of
- Checked by:
- Approved by:
- Revision:
- Document No:
- Size:
- Date:
- A3

### Library data of the parts
C88 = _CAP_C_2: CAP
D5-D12 = Diode SMD: Default Diode; Code - JEDEC: DO-214-AB; Value: 1N5007; Published: 8-Jun-2000; Revision: July-2002: Re-released for DXP Platform.; Publisher: Altium Limited
J7 J8 = Header 8x1_2M
Q3-Q10 = MOSFET_N: N-Channel 30 V 5.7A (Ta) 1.4W (Ta) Surface Mount SOT-23-3; MF: Alpha & Omega Semiconductor; SnapEDA_Link: https://www.snapeda.com/parts/AO3400A/Alpha/view-part/?ref=snap; Package: SOT-23 Alpha &amp; Omega Semiconductor Inc.; Value: *; MP: AO3400A; Check_prices: https://www.snapeda.com/parts/AO3400A/Alpha/view-part/?ref=eda
R152-R167 = _RES_B_2: RES

## Sheet 16_TEC.SchDoc
size 420 x 297 mm; SheetNumber: 26; SheetTotal: 36
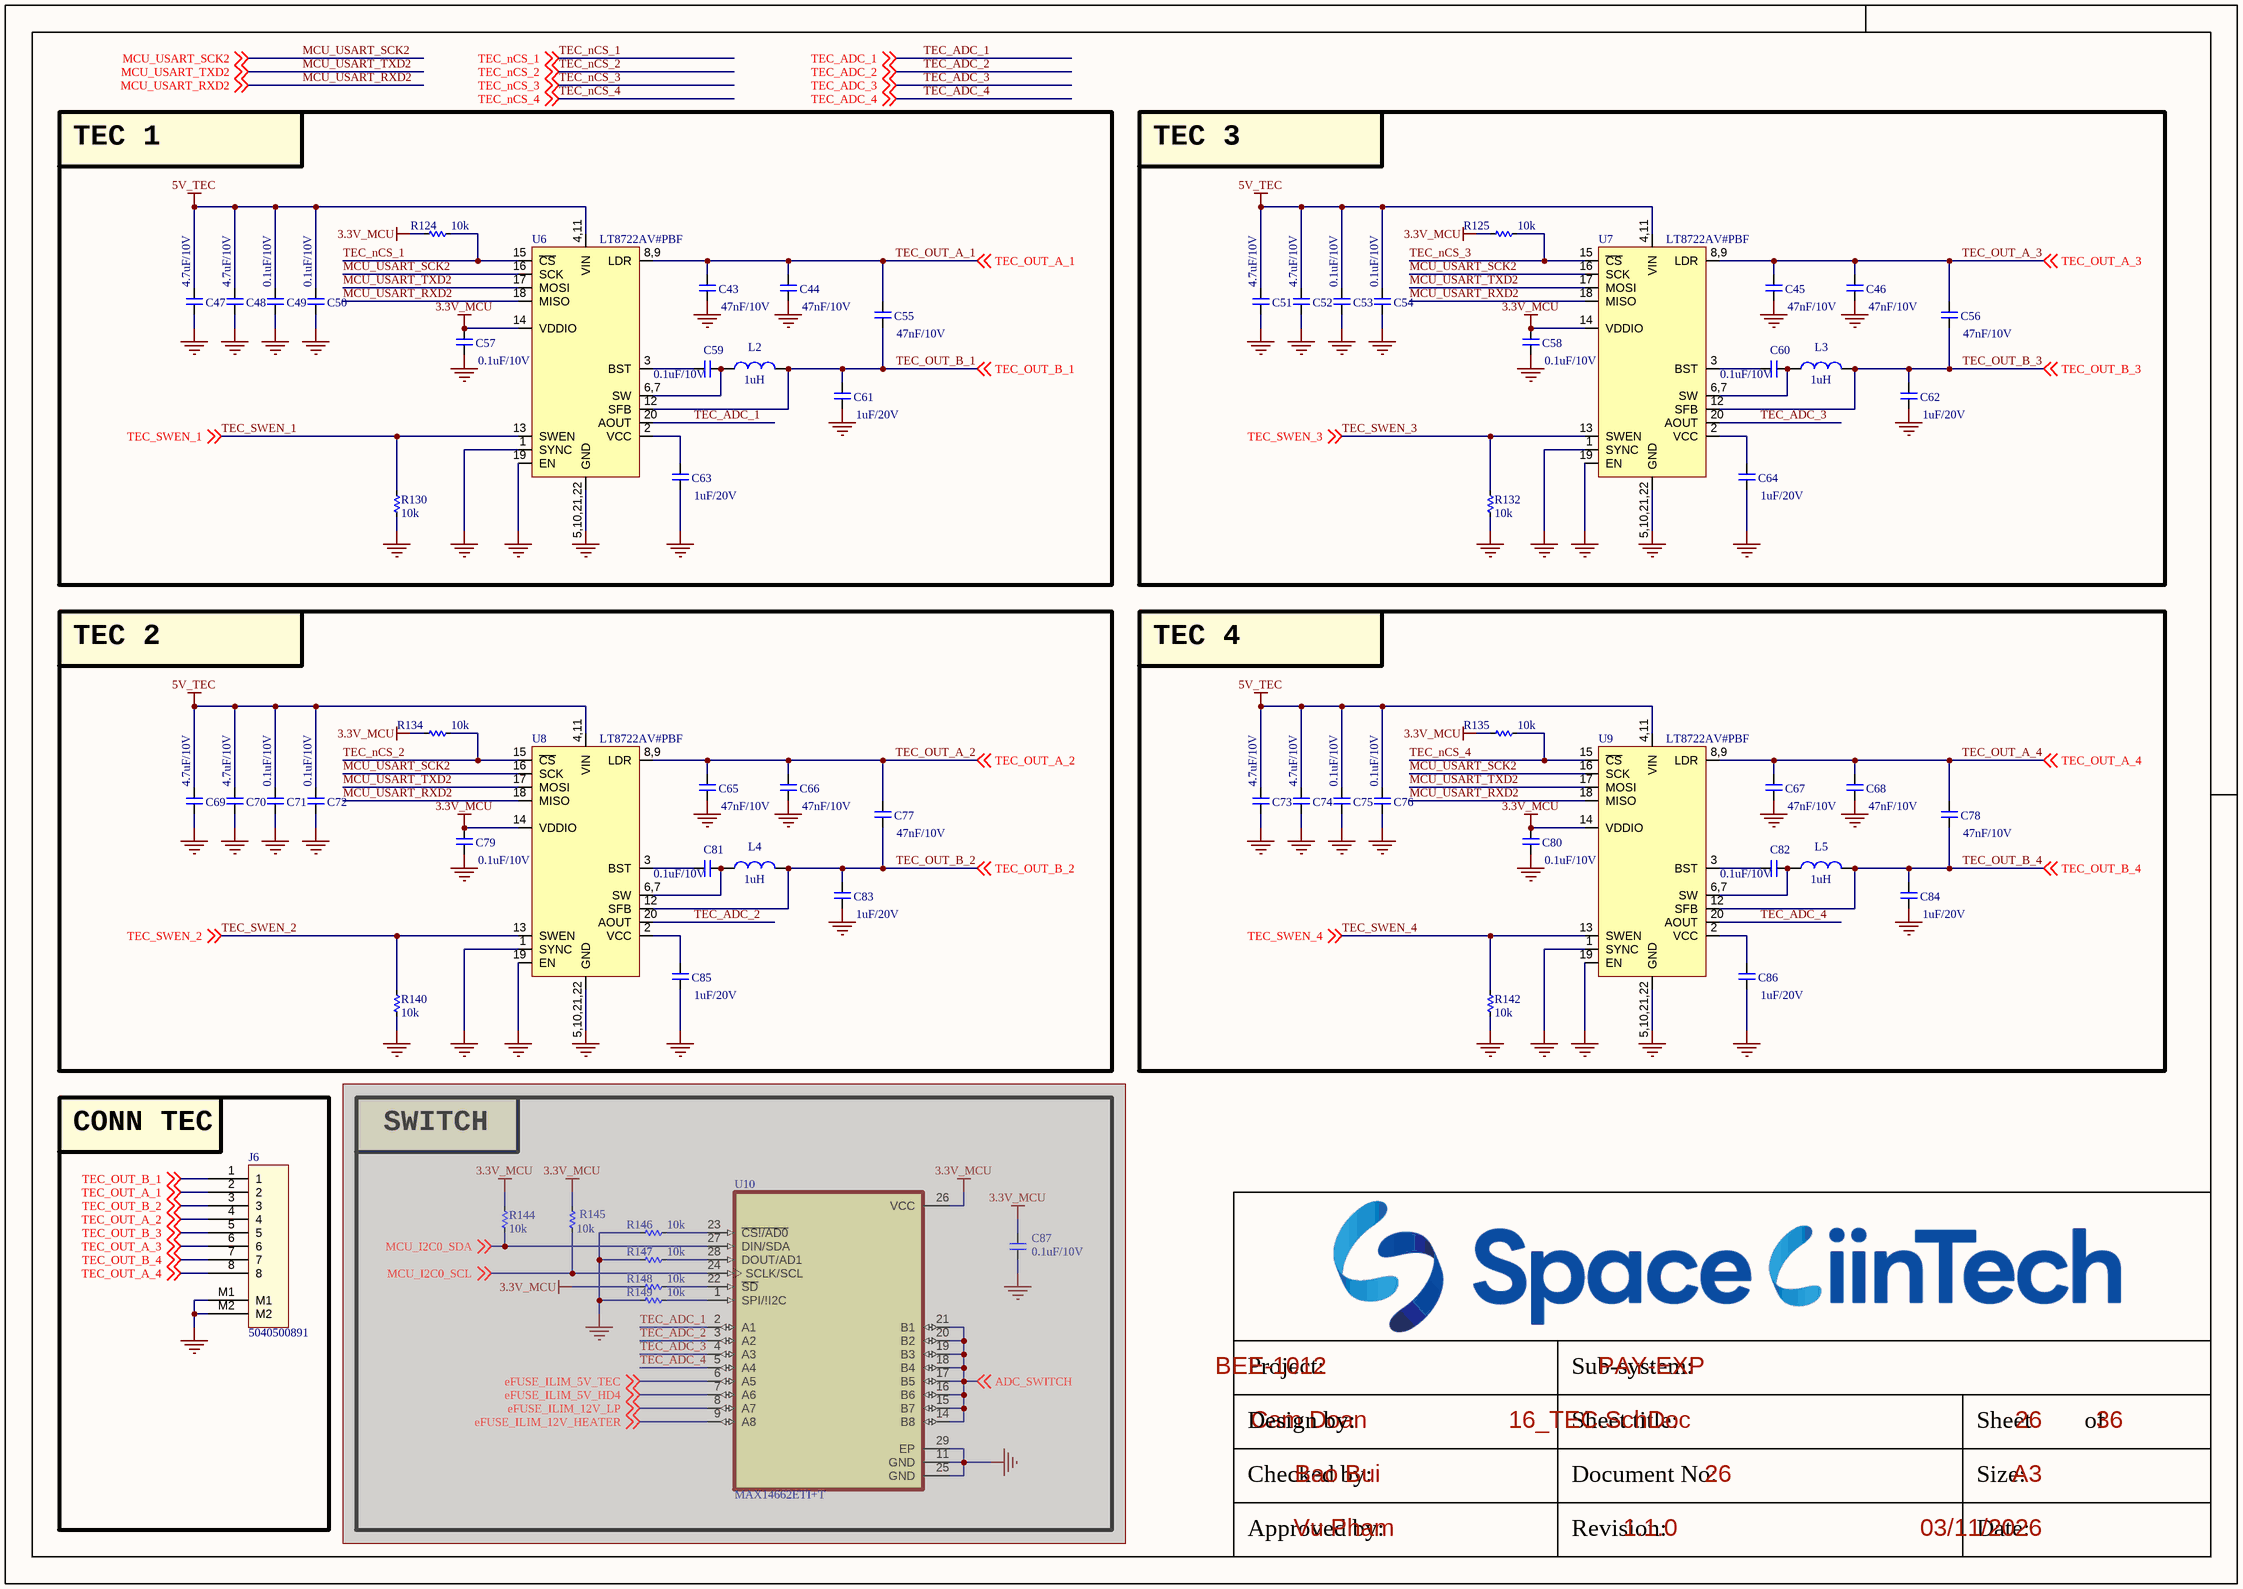
[diagram p27: 16_TEC.SchDoc]

### Parts
(Parts that share a designator on the sheet are numbered #1, #2 ... from top to bottom, then left to right.)
C43  47nF/10V  [CAP_C_1005X50_L]
C44  47nF/10V  [CAP_C_1005X50_L]
C45  47nF/10V  [CAP_C_1005X50_L]
C46  47nF/10V  [CAP_C_1005X50_L]
C47  4.7uF/10V  [CAP_C_1005X50_L]
C48  4.7uF/10V  [CAP_C_1005X50_L]
C49  0.1uF/10V  [CAP_C_1005X50_L]
C50  0.1uF/10V  [CAP_C_1005X50_L]
C51  4.7uF/10V  [CAP_C_1005X50_L]
C52  4.7uF/10V  [CAP_C_1005X50_L]
C53  0.1uF/10V  [CAP_C_1005X50_L]
C54  0.1uF/10V  [CAP_C_1005X50_L]
C55  47nF/10V  [CAP_C_1005X50_L]
C56  47nF/10V  [CAP_C_1005X50_L]
C57  0.1uF/10V  [CAP_C_1005X50_L]
C58  0.1uF/10V  [CAP_C_1005X50_L]
C59  0.1uF/10V  [CAP_C_1005X50_L]
C60  0.1uF/10V  [CAP_C_1005X50_L]
C61  1uF/20V  [CAP_C_1005X50_L]
C62  1uF/20V  [CAP_C_1005X50_L]
C63  1uF/20V  [CAP_C_1005X50_L]
C64  1uF/20V  [CAP_C_1005X50_L]
C65  47nF/10V  [CAP_C_1005X50_L]
C66  47nF/10V  [CAP_C_1005X50_L]
C67  47nF/10V  [CAP_C_1005X50_L]
C68  47nF/10V  [CAP_C_1005X50_L]
C69  4.7uF/10V  [CAP_C_1005X50_L]
C70  4.7uF/10V  [CAP_C_1005X50_L]
C71  0.1uF/10V  [CAP_C_1005X50_L]
C72  0.1uF/10V  [CAP_C_1005X50_L]
C73  4.7uF/10V  [CAP_C_1005X50_L]
C74  4.7uF/10V  [CAP_C_1005X50_L]
C75  0.1uF/10V  [CAP_C_1005X50_L]
C76  0.1uF/10V  [CAP_C_1005X50_L]
C77  47nF/10V  [CAP_C_1005X50_L]
C78  47nF/10V  [CAP_C_1005X50_L]
C79  0.1uF/10V  [CAP_C_1005X50_L]
C80  0.1uF/10V  [CAP_C_1005X50_L]
C81  0.1uF/10V  [CAP_C_1005X50_L]
C82  0.1uF/10V  [CAP_C_1005X50_L]
C83  1uF/20V  [CAP_C_1005X50_L]
C84  1uF/20V  [CAP_C_1005X50_L]
C85  1uF/20V  [CAP_C_1005X50_L]
C86  1uF/20V  [CAP_C_1005X50_L]
C87#1  0.1uF/10V  [CAP_C_1005X50_L]  (masked out: inside a compile mask, not in the netlist)
J6  5040500891  [MOLEX_5040500891]
L2  1uH  [L-SMD-M-3.5x3.5x2mm]
L3  1uH  [L-SMD-M-3.5x3.5x2mm]
L4  1uH  [L-SMD-M-3.5x3.5x2mm]
L5  1uH  [L-SMD-M-3.5x3.5x2mm]
R124  10k  [RES_C_1005x30_L]
R125  10k  [RES_C_1005x30_L]
R130  10k  [RES_C_1005x30_L]
R132  10k  [RES_C_1005x30_L]
R134  10k  [RES_C_1005x30_L]
R135  10k  [RES_C_1005x30_L]
R140  10k  [RES_C_1005x30_L]
R142  10k  [RES_C_1005x30_L]
R144#1  10k  [RES_C_1005x30_L]  (masked out: inside a compile mask, not in the netlist)
R145#1  10k  [RES_C_1005x30_L]  (masked out: inside a compile mask, not in the netlist)
R146#1  10k  [RES_C_1005x30_L]  (masked out: inside a compile mask, not in the netlist)
R147#1  10k  [RES_C_1005x30_L]  (masked out: inside a compile mask, not in the netlist)
R148#1  10k  [RES_C_1005x30_L]  (masked out: inside a compile mask, not in the netlist)
R149#1  10k  [RES_C_1005x30_L]  (masked out: inside a compile mask, not in the netlist)
U6  LT8722AV#PBF  [QFN18]
U7  LT8722AV#PBF  [QFN18]
U8  LT8722AV#PBF  [QFN18]
U9  LT8722AV#PBF  [QFN18]
U10#1  MAX14662ETI+T  [QFN40P400X400X80-29N]  (masked out: inside a compile mask, not in the netlist)

### Blocks framed on the sheet
TEC 1: C43 C44 C47-C50 C55 C57 C59 C61 C63 L2 R124 R130 U6
TEC 3: C45 C46 C51-C54 C56 C58 C60 C62 C64 L3 R125 R132 U7
TEC 2: C65 C66 C69-C72 C77 C79 C81 C83 C85 L4 R134 R140 U8
TEC 4: C67 C68 C73-C76 C78 C80 C82 C84 C86 L5 R135 R142 U9
CONN TEC: J6
SWITCH: C87#1 R144#1 R145#1 R146#1 R147#1 R148#1 R149#1 U10#1

### Nets
3.3V_MCU: C57.2 C58.2 C79.2 C80.2 R124.1 R125.1 R134.1 R135.1 U6.14(VDDIO) U7.14(VDDIO) U8.14(VDDIO) U9.14(VDDIO)
5V_TEC: C47.2 C48.2 C49.2 C50.2 C51.2 C52.2 C53.2 C54.2 C69.2 C70.2 C71.2 C72.2 C73.2 C74.2 C75.2 C76.2 U6.4,11(VIN) U7.4,11(VIN) U8.4,11(VIN) U9.4,11(VIN)
GND: C43.1 C44.1 C45.1 C46.1 C47.1 C48.1 C49.1 C50.1 C51.1 C52.1 C53.1 C54.1 C57.1 C58.1 C61.1 C62.1 C63.1 C64.1 C65.1 C66.1 C67.1 C68.1 C69.1 C70.1 C71.1 C72.1 C73.1 C74.1 C75.1 C76.1 C79.1 C80.1 C83.1 C84.1 C85.1 C86.1 J6.M1 J6.M2 R130.2 R132.2 R140.2 R142.2 U6.1(SYNC) U6.5,10,21,22(GND) U6.19(EN) U7.1(SYNC) U7.5,10,21,22(GND) U7.19(EN) U8.1(SYNC) U8.5,10,21,22(GND) U8.19(EN) U9.1(SYNC) U9.5,10,21,22(GND) U9.19(EN)
MCU_USART_RXD2: U6.18(MISO) U7.18(MISO) U8.18(MISO) U9.18(MISO) ; off-sheet MCU_USART_RXD2
MCU_USART_SCK2: U6.16(SCK) U7.16(SCK) U8.16(SCK) U9.16(SCK) ; off-sheet MCU_USART_SCK2
MCU_USART_TXD2: U6.17(MOSI) U7.17(MOSI) U8.17(MOSI) U9.17(MOSI) ; off-sheet MCU_USART_TXD2
TEC_ADC_1: U6.20(AOUT) ; off-sheet TEC_ADC_1
TEC_ADC_2: U8.20(AOUT) ; off-sheet TEC_ADC_2
TEC_ADC_3: U7.20(AOUT) ; off-sheet TEC_ADC_3
TEC_ADC_4: U9.20(AOUT) ; off-sheet TEC_ADC_4
TEC_nCS_1: R124.2 U6.15(~{CS}) ; off-sheet TEC_nCS_1
TEC_nCS_2: R134.2 U8.15(~{CS}) ; off-sheet TEC_nCS_2
TEC_nCS_3: R125.2 U7.15(~{CS}) ; off-sheet TEC_nCS_3
TEC_nCS_4: R135.2 U9.15(~{CS}) ; off-sheet TEC_nCS_4
TEC_OUT_A_1: C43.2 C44.2 C55.2 J6.2 U6.8,9(LDR) ; off-sheet TEC_OUT_A_1
TEC_OUT_A_2: C65.2 C66.2 C77.2 J6.4 U8.8,9(LDR) ; off-sheet TEC_OUT_A_2
TEC_OUT_A_3: C45.2 C46.2 C56.2 J6.6 U7.8,9(LDR) ; off-sheet TEC_OUT_A_3
TEC_OUT_A_4: C67.2 C68.2 C78.2 J6.8 U9.8,9(LDR) ; off-sheet TEC_OUT_A_4
TEC_OUT_B_1: C55.1 C61.2 J6.1 L2.2 U6.12(SFB) ; off-sheet TEC_OUT_B_1
TEC_OUT_B_2: C77.1 C83.2 J6.3 L4.2 U8.12(SFB) ; off-sheet TEC_OUT_B_2
TEC_OUT_B_3: C56.1 C62.2 J6.5 L3.2 U7.12(SFB) ; off-sheet TEC_OUT_B_3
TEC_OUT_B_4: C78.1 C84.2 J6.7 L5.2 U9.12(SFB) ; off-sheet TEC_OUT_B_4
TEC_SWEN_1: R130.1 U6.13(SWEN) ; off-sheet TEC_SWEN_1
TEC_SWEN_2: R140.1 U8.13(SWEN) ; off-sheet TEC_SWEN_2
TEC_SWEN_3: R132.1 U7.13(SWEN) ; off-sheet TEC_SWEN_3
TEC_SWEN_4: R142.1 U9.13(SWEN) ; off-sheet TEC_SWEN_4
NetC59_1: C59.1 L2.1 U6.6,7(SW)
NetC59_2: C59.2 U6.3(BST)
NetC60_1: C60.1 L3.1 U7.6,7(SW)
NetC60_2: C60.2 U7.3(BST)
NetC63_2: C63.2 U6.2(VCC)
NetC64_2: C64.2 U7.2(VCC)
NetC81_1: C81.1 L4.1 U8.6,7(SW)
NetC81_2: C81.2 U8.3(BST)
NetC82_1: C82.1 L5.1 U9.6,7(SW)
NetC82_2: C82.2 U9.3(BST)
NetC85_2: C85.2 U8.2(VCC)
NetC86_2: C86.2 U9.2(VCC)

### Notes on the sheet
- Project:
- Sub-system:
- Design by:
- Sheet title:
- Sheet
- of
- Checked by:
- Approved by:
- Revision:
- Document No:
- Size:
- Date:
- A3

### Library data of the parts
C43-C86 C87#1 = _CAP_C_2: CAP
J6 = Header 8x1_2M
L2-L5 = L-SMD-1: partNo: 78477010; Manufacturer: Wurth Elektronik; Inductance: 1.0 μH; ComponentLink1Description: Manufacturer; ComponentLink1URL: http://www.we-online.de; Created by: Baojun Chen; Created Date: Nov.2015; ComponentLink2Description: Datasheet; ComponentLink2URL: http://katalog.we-online.de/pbs/datasheet/78477010.pdf
R124 R125 R130 R132 R134 R135 R140 R142 R144#1 R145#1 R146#1 R147#1 R148#1 R149#1 = _RES_B_2: RES
U6-U9 = LT8722
U10#1 = IC_SW_MAX14662ETI+T: 8 Circuit IC Switch 1:1 1Ohm 28-TQFN _4x4_; MF: Maxim Integrated; Package: TQFN-28 Maxim; Value: *; Price: None; MP: MAX14662ETI+T; SnapEDA_Link: https://www.snapeda.com/parts/MAX14662ETI%2BT/Maxim%20Integrated/view-part/546683/?ref=snap; Availability: Unavailable

## Sheet 17_FLOW_Sensor.SchDoc
size 420 x 297 mm; SheetNumber: 27; SheetTotal: 36
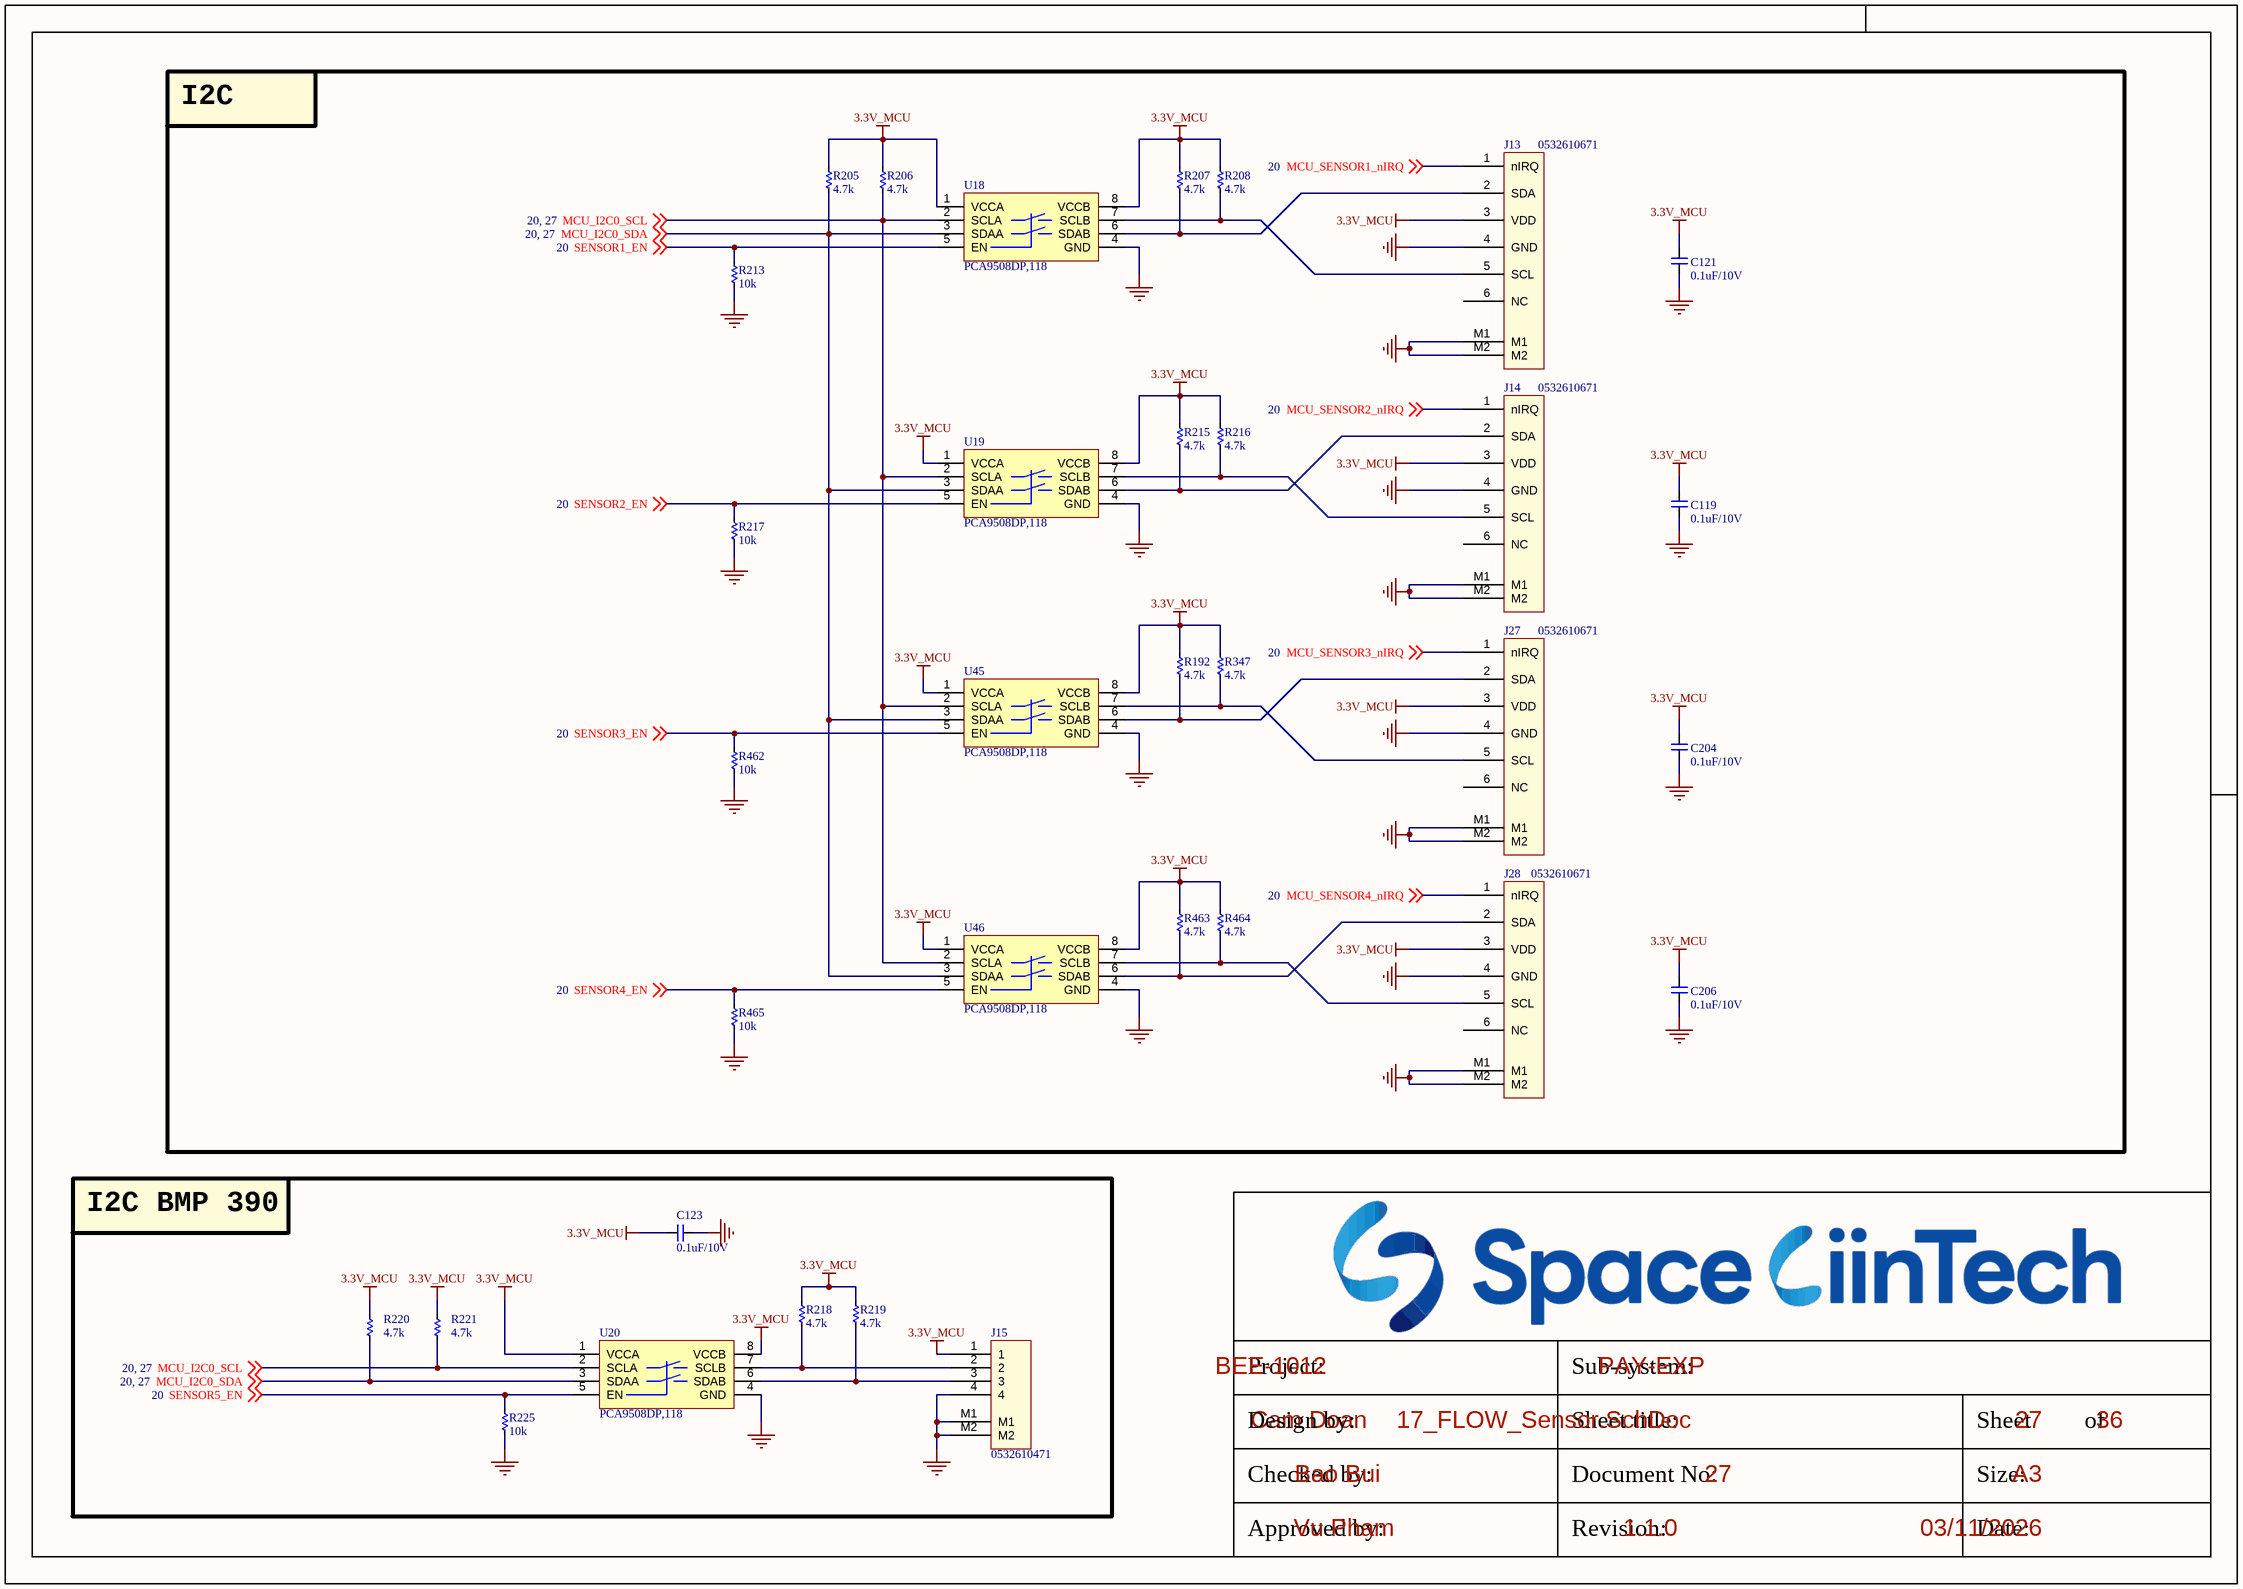
[diagram p28: 17_FLOW_Sensor.SchDoc]

### Parts
C119  0.1uF/10V  [CAP_C_1005X60]
C121  0.1uF/10V  [CAP_C_1005X60]
C123  0.1uF/10V  [CAP_C_1005X60]
C204  0.1uF/10V  [CAP_C_1005X60]
C206  0.1uF/10V  [CAP_C_1005X60]
J13  0532610671  [MOLEX_0532610671]
J14  0532610671  [MOLEX_0532610671]
J15  0532610471  [MOLEX_0532610471]
J27  0532610671  [MOLEX_0532610671]
J28  0532610671  [MOLEX_0532610671]
R192  4.7k  [RES_C_1005X40]
R205  4.7k  [RES_C_1005X40]
R206  4.7k  [RES_C_1005X40]
R207  4.7k  [RES_C_1005X40]
R208  4.7k  [RES_C_1005X40]
R213  10k  [RES_C_1005X40]
R215  4.7k  [RES_C_1005X40]
R216  4.7k  [RES_C_1005X40]
R217  10k  [RES_C_1005X40]
R218  4.7k  [RES_C_1005X40]
R219  4.7k  [RES_C_1005X40]
R220  4.7k  [RES_C_1005X40]
R221  4.7k  [RES_C_1005X40]
R225  10k  [RES_C_1005X40]
R347  4.7k  [RES_C_1005X40]
R462  10k  [RES_C_1005X40]
R463  4.7k  [RES_C_1005X40]
R464  4.7k  [RES_C_1005X40]
R465  10k  [RES_C_1005X40]
U18  PCA9508DP,118  [TSOP8]
U19  PCA9508DP,118  [TSOP8]
U20  PCA9508DP,118  [TSOP8]
U45  PCA9508DP,118  [TSOP8]
U46  PCA9508DP,118  [TSOP8]

### Blocks framed on the sheet
I2C: C119 C121 C204 C206 J13 J14 J27 J28 R192 R205-R208 R213 R215-R217 R347 R462-R465 U18 U19 U45 U46
I2C BMP 390: C123 J15 R218-R221 R225 U20

### Nets
3.3V_MCU: C119.2 C121.2 C123.2 C204.2 C206.2 J13.3(VDD) J14.3(VDD) J15.1 J27.3(VDD) J28.3(VDD) R192.1 R205.1 R206.1 R207.1 R208.1 R215.1 R216.1 R218.1 R219.1 R220.1 R221.1 R347.1 R463.1 R464.1 U18.1(VCCA) U18.8(VCCB) U19.1(VCCA) U19.8(VCCB) U20.1(VCCA) U20.8(VCCB) U45.1(VCCA) U45.8(VCCB) U46.1(VCCA) U46.8(VCCB)
GND: C119.1 C121.1 C123.1 C204.1 C206.1 J13.4(GND) J13.M1 J13.M2 J14.4(GND) J14.M1 J14.M2 J15.4 J15.M1 J15.M2 J27.4(GND) J27.M1 J27.M2 J28.4(GND) J28.M1 J28.M2 R213.2 R217.2 R225.2 R462.2 R465.2 U18.4(GND) U19.4(GND) U20.4(GND) U45.4(GND) U46.4(GND)
MCU_I2C0_SCL: R206.2 R221.2 U18.2(SCLA) U19.2(SCLA) U20.2(SCLA) U45.2(SCLA) U46.2(SCLA) ; off-sheet MCU_I2C0_SCL
MCU_I2C0_SDA: R205.2 R220.2 U18.3(SDAA) U19.3(SDAA) U20.3(SDAA) U45.3(SDAA) U46.3(SDAA) ; off-sheet MCU_I2C0_SDA
MCU_SENSOR1_nIRQ: J13.1(nIRQ) ; off-sheet MCU_SENSOR1_nIRQ
MCU_SENSOR2_nIRQ: J14.1(nIRQ) ; off-sheet MCU_SENSOR2_nIRQ
MCU_SENSOR3_nIRQ: J27.1(nIRQ) ; off-sheet MCU_SENSOR3_nIRQ
MCU_SENSOR4_nIRQ: J28.1(nIRQ) ; off-sheet MCU_SENSOR4_nIRQ
SENSOR1_EN: R213.1 U18.5(EN) ; off-sheet SENSOR1_EN
SENSOR2_EN: R217.1 U19.5(EN) ; off-sheet SENSOR2_EN
SENSOR3_EN: R462.1 U45.5(EN) ; off-sheet SENSOR3_EN
SENSOR4_EN: R465.1 U46.5(EN) ; off-sheet SENSOR4_EN
SENSOR5_EN: R225.1 U20.5(EN) ; off-sheet SENSOR5_EN
NetJ13_2: J13.2(SDA) R207.2 U18.6(SDAB)
NetJ13_5: J13.5(SCL) R208.2 U18.7(SCLB)
NetJ14_2: J14.2(SDA) R215.2 U19.6(SDAB)
NetJ14_5: J14.5(SCL) R216.2 U19.7(SCLB)
NetJ15_2: J15.2 R218.2 U20.7(SCLB)
NetJ15_3: J15.3 R219.2 U20.6(SDAB)
NetJ27_2: J27.2(SDA) R192.2 U45.6(SDAB)
NetJ27_5: J27.5(SCL) R347.2 U45.7(SCLB)
NetJ28_2: J28.2(SDA) R463.2 U46.6(SDAB)
NetJ28_5: J28.5(SCL) R464.2 U46.7(SCLB)

Not connected (* = marked no-connect by the designer): J13 6(NC); J14 6(NC); J27 6(NC); J28 6(NC)

### Notes on the sheet
- Project:
- Sub-system:
- Design by:
- Sheet title:
- Sheet
- of
- Checked by:
- Approved by:
- Revision:
- Document No:
- Size:
- Date:
- A3

### Library data of the parts
C119 C121 C123 C204 C206 = _CAP_C_2: CAP
J13 J14 J27 J28 = FLOW_SENSOR
J15 = Header 4x1_2M
R192 R205-R208 R213 R215-R221 R225 R347 R462-R465 = _RES_B_2: RES

## Sheet 17_I2C_Sensor_OnBoard.SchDoc
size 420 x 297 mm; SheetNumber: 28; SheetTotal: 35
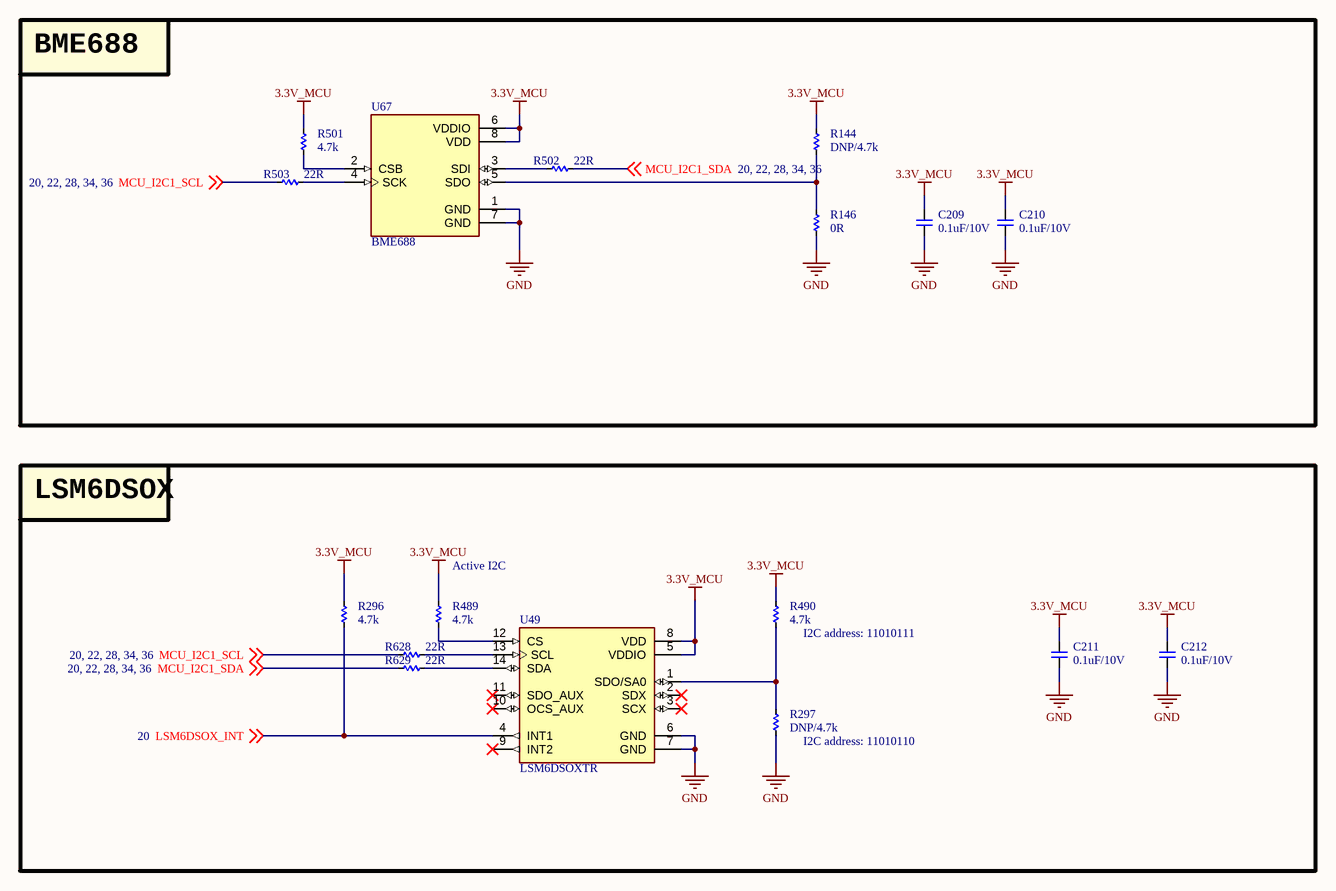
[diagram p29: 17_I2C_Sensor_OnBoard.SchDoc]

### Parts
(Parts that share a designator on the sheet are numbered #1, #2 ... from top to bottom, then left to right.)
C209  0.1uF/10V  [CAP_C_1005X60]
C210  0.1uF/10V  [CAP_C_1005X60]
C211  0.1uF/10V  [CAP_C_1005X60]
C212  0.1uF/10V  [CAP_C_1005X60]
R144#2  DNP/4.7k  [RES_C_1005X40]
R146#2  0R  [RES_C_1005X40]
R296  4.7k  [RES_C_1005X40]
R297  DNP/4.7k  [RES_C_1005X40]
R489  4.7k  [RES_C_1005X40]
R490  4.7k  [RES_C_1005X40]
R501  4.7k  [RES_C_1005X40]
R502  22R  [RES_C_1005X40]
R503  22R  [RES_C_1005X40]
R628  22R  [RES_C_1005X40]
R629  22R  [RES_C_1005X40]
U49  LSM6DSOXTR  [PQFN50P250X300X86-14N]
U67  BME688  [IC_BME688]

### Blocks framed on the sheet
BME688: C209 C210 R144#2 R146#2 R501-R503 U67
LSM6DSOX: C211 C212 R296 R297 R489 R490 R628 R629 U49

### Nets
3.3V_MCU: C209.2 C210.2 C211.2 C212.2 R144#2.1 R296.1 R489.1 R490.1 R501.1 U49.5(VDDIO) U49.8(VDD) U67.6(VDDIO) U67.8(VDD)
GND: C209.1 C210.1 C211.1 C212.1 R146#2.2 R297.2 U49.6(GND) U49.7(GND) U67.1(GND) U67.7(GND)
LSM6DSOX_INT: R296.2 U49.4(INT1) ; off-sheet LSM6DSOX_INT
MCU_I2C1_SCL: R503.1 R628.1 ; off-sheet MCU_I2C1_SCL
MCU_I2C1_SDA: R502.2 R629.1 ; off-sheet MCU_I2C1_SDA
NetR144#2_2: R144#2.2 R146#2.1 U67.5(SDO)
NetR297_1: R297.1 R490.2 U49.1(SDO/SA0)
NetR489_2: R489.2 U49.12(CS)
NetR501_2: R501.2 U67.2(CSB)
NetR502_1: R502.1 U67.3(SDI)
NetR503_2: R503.2 U67.4(SCK)
NetR628_2: R628.2 U49.13(SCL)
NetR629_2: R629.2 U49.14(SDA)

Not connected (* = marked no-connect by the designer): U49 2(SDX)* 3(SCX)* 9(INT2)* 10(OCS_AUX)* 11(SDO_AUX)*

### Notes on the sheet
- (near R489) Active I2C
- (near R490) I2C address: 11010111
- (near R297) I2C address: 11010110
- Project:
- Sub-system:
- Design by:
- Sheet title:
- Sheet
- of
- Checked by:
- Approved by:
- Revision:
- Document No:
- Size:
- Date:
- A3

### Library data of the parts
C209-C212 = _CAP_C_2: CAP
R144#2 R146#2 R296 R297 R489 R490 R501-R503 R628 R629 = _RES_B_2: RES
U49 = LSM6DSOXTR: Accelerometer, Gyroscope, 6 Axis Sensor I2C, SPI Output; MF: STMicroelectronics; SnapEDA_Link: https://www.snapeda.com/parts/LSM6DSOXTR/STMicroelectronics/view-part/?ref=snap; Package: VFLGA-14 STMicroelectronics; Value: *; MP: LSM6DSOXTR; Check_prices: https://www.snapeda.com/parts/LSM6DSOXTR/STMicroelectronics/view-part/?ref=eda
U67 = BME688: Gas sensor measuring relative humidity, barometric pressure, ambient temperature and gas (VOC); Package: None; MP: BME688; Price: None; Availability: Unavailable; Value: *

## Sheet 18_HD4_PUMP.SchDoc
size 420 x 297 mm; SheetNumber: 29; SheetTotal: 36
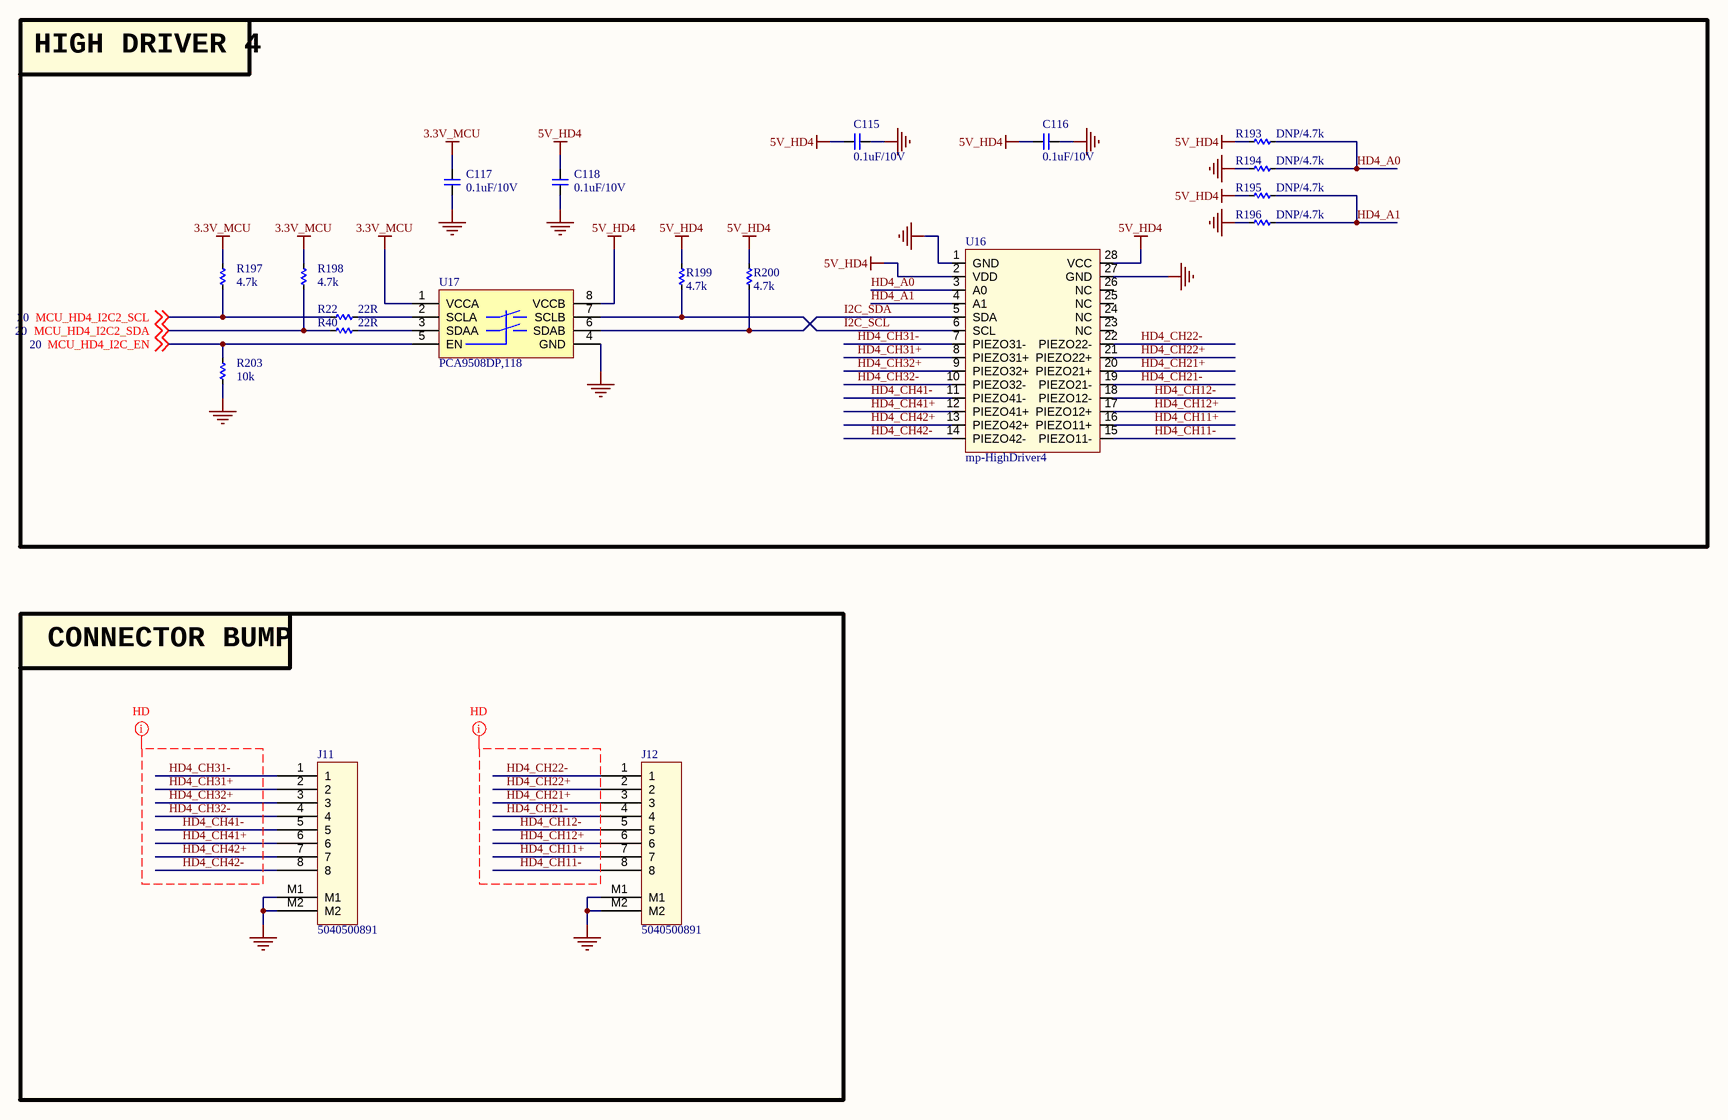
[diagram p30: 18_HD4_PUMP.SchDoc]

### Parts
C115  0.1uF/10V  [CAP_C_1005X60]
C116  0.1uF/10V  [CAP_C_1005X60]
C117  0.1uF/10V  [CAP_C_1005X60]
C118  0.1uF/10V  [CAP_C_1005X60]
J11  5040500891  [MOLEX_5040500891]
J12  5040500891  [MOLEX_5040500891]
R22  22R  [RES_C_1005X40]
R40  22R  [RES_C_1005X40]
R193  DNP/4.7k  [RES_C_1005X40]
R194  DNP/4.7k  [RES_C_1005X40]
R195  DNP/4.7k  [RES_C_1005X40]
R196  DNP/4.7k  [RES_C_1005X40]
R197  4.7k  [RES_C_1005X40]
R198  4.7k  [RES_C_1005X40]
R199  4.7k  [RES_C_1005X40]
R200  4.7k  [RES_C_1005X40]
R203  10k  [RES_C_1005X40]
U16  mp-HighDriver4  [MP_HIGHDRIVER4]
U17  PCA9508DP,118  [TSOP8]

### Blocks framed on the sheet
HIGH DRIVER 4: C115-C118 R22 R40 R193-R200 R203 U16 U17
CONNECTOR BUMP: J11 J12

### Nets
3.3V_MCU: C117.2 R197.1 R198.1 U17.1(VCCA)
5V_HD4: C115.2 C116.2 C118.2 R193.1 R195.1 R199.1 R200.1 U16.2(VDD) U16.28(VCC) U17.8(VCCB)
GND: C115.1 C116.1 C117.1 C118.1 J11.M1 J11.M2 J12.M1 J12.M2 R194.1 R196.1 R203.2 U16.1(GND) U16.27(GND) U17.4(GND)
HD4_A0: R193.2 R194.2 U16.3(A0)
HD4_A1: R195.2 R196.2 U16.4(A1)
HD4_CH11+: J12.7 U16.16(PIEZO11+)
HD4_CH11-: J12.8 U16.15(PIEZO11-)
HD4_CH12+: J12.6 U16.17(PIEZO12+)
HD4_CH12-: J12.5 U16.18(PIEZO12-)
HD4_CH21+: J12.3 U16.20(PIEZO21+)
HD4_CH21-: J12.4 U16.19(PIEZO21-)
HD4_CH22+: J12.2 U16.21(PIEZO22+)
HD4_CH22-: J12.1 U16.22(PIEZO22-)
HD4_CH31+: J11.2 U16.8(PIEZO31+)
HD4_CH31-: J11.1 U16.7(PIEZO31-)
HD4_CH32+: J11.3 U16.9(PIEZO32+)
HD4_CH32-: J11.4 U16.10(PIEZO32-)
HD4_CH41+: J11.6 U16.12(PIEZO41+)
HD4_CH41-: J11.5 U16.11(PIEZO41-)
HD4_CH42+: J11.7 U16.13(PIEZO42+)
HD4_CH42-: J11.8 U16.14(PIEZO42-)
I2C_SCL: R199.2 U16.6(SCL) U17.7(SCLB)
I2C_SDA: R200.2 U16.5(SDA) U17.6(SDAB)
MCU_HD4_I2C2_SCL: R22.1 R197.2 ; off-sheet MCU_HD4_I2C2_SCL
MCU_HD4_I2C2_SDA: R40.1 R198.2 ; off-sheet MCU_HD4_I2C2_SDA
MCU_HD4_I2C_EN: R203.1 U17.5(EN) ; off-sheet MCU_HD4_I2C_EN
NetR22_2: R22.2 U17.2(SCLA)
NetR40_2: R40.2 U17.3(SDAA)

Not connected (* = marked no-connect by the designer): U16 23(NC) 24(NC) 25(NC) 26(NC)

### Layout directives
net class HD: HD4_CH11+, HD4_CH11-, HD4_CH12+, HD4_CH12-, HD4_CH21+, HD4_CH21-, HD4_CH22+, HD4_CH22-, HD4_CH31+, HD4_CH31-, HD4_CH32+, HD4_CH32-, HD4_CH41+, HD4_CH41-, HD4_CH42+, HD4_CH42-

### Notes on the sheet
- Project:
- Sub-system:
- Design by:
- Sheet title:
- Sheet
- of
- Checked by:
- Approved by:
- Revision:
- Document No:
- Size:
- Date:
- A3

### Library data of the parts
C115-C118 = _CAP_C_2: CAP
J11 J12 = Header 8x1_2M
R22 R40 R193-R200 R203 = _RES_B_2: RES
U16 = mp_HighDriver4

## Sheet 18_HD4_PUMP_2.SchDoc
size 420 x 297 mm; SheetNumber: 30; SheetTotal: 36
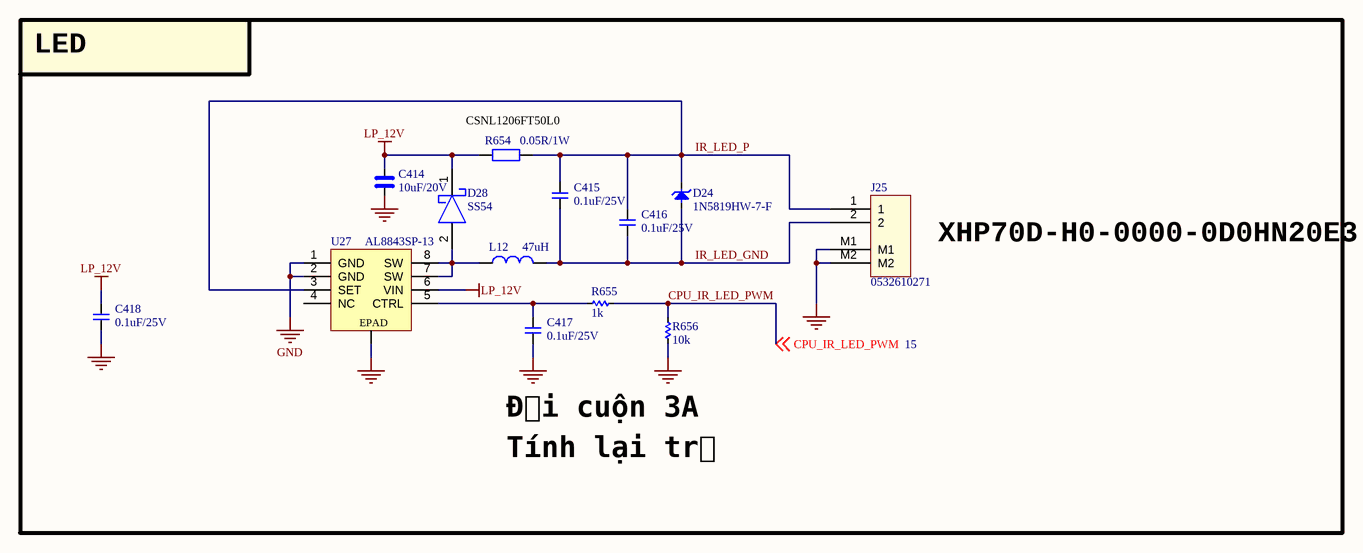
[diagram p31: 18_HD4_PUMP_2.SchDoc]

### Parts
C414  10uF/20V  [CAP_C_2012X110]
C415  0.1uF/25V  [CAP_C_1608X80]
C416  0.1uF/25V  [CAP_C_1608X80]
C417  0.1uF/25V  [CAP_C_1608X80]
C418  0.1uF/25V  [CAP_C_1608X80]
D24  1N5819HW-7-F  [SOD3717X145N]
D28  SS54  [DO-214AC_SMA]
J25  0532610271  [MOLEX_5040500291]
L12  47uH  [IND_MP_1250x1250x850]
R654  0.05R/1W  [RES_C_3216X70]
R655  1k  [RES_C_1608X60]
R656  10k  [RES_C_1608X60]
U27  AL8843SP-13  [SOIC127P602X173-8N_EPAD]

### Nets
GND: C414.2 C417.1 C418.1 J25.M1 J25.M2 R656.2 U27.1(GND) U27.2(GND) U27.9(EPAD)
LP_12V: C414.1 C418.2 D28.1 R654.1 U27.6(VIN)
CPU_IR_LED_PWM: R655.2 R656.1 ; off-sheet CPU_IR_LED_PWM
IR_LED_GND: C415.1 C416.1 D24.2(A) J25.2 L12.2
IR_LED_P: C415.2 C416.2 D24.1(K) J25.1 R654.2 U27.3(SET)
NetC417_2: C417.2 R655.1 U27.5(CTRL)
NetD28_2: D28.2 L12.1 U27.7(SW) U27.8(SW)

Not connected (* = marked no-connect by the designer): U27 4(NC)

### Notes on the sheet
- LED
- (near R654) CSNL1206FT50L0
- XHP70D-H0-0000-0D0HN20E3
- Đổi cuộn 3A
- Tính lại trở
- Project:
- Sub-system:
- Design by:
- Sheet title:
- Sheet
- of
- Checked by:
- Approved by:
- Revision:
- Document No:
- Size:
- Date:
- A3

### Library data of the parts
C414 = _CAP_C_High_2: CAP High Value
C415-C418 = _CAP_C_2: CAP
D24 = DIODE Zener: Zenner
D28 = SS54: DIODE SCHOTTKY 60V 3A DO214AA
J25 = Header 2x1_2M
L12 = L-SMD-1: B82477P4473M000; partNo: 78477010; Manufacturer: Wurth Elektronik; Inductance: 1.0 μH; ComponentLink1Description: Manufacturer; ComponentLink1URL: http://www.we-online.de; Created by: Baojun Chen; Created Date: Nov.2015; ComponentLink2Description: Datasheet; ComponentLink2URL: http://katalog.we-online.de/pbs/datasheet/78477010.pdf
R654 = _RES: RES; Chung_Loai: Dán; Don_Vi: Con; So_Chan: 2; Ten_Linh_Kien: Trở 0603 1% 10k; Ma_Hang: MH006333; Kieu_Chan: *
R655 R656 = _RES_B_2: RES
U27 = AL8843SP-13: IC LED DRIVER RGLTR PWM 3A 8SO